# EAGLE design TINRS - PicoLooper (EAGLE 7.7.0)

## Sheet 1 of 5: MCU & Eeprom
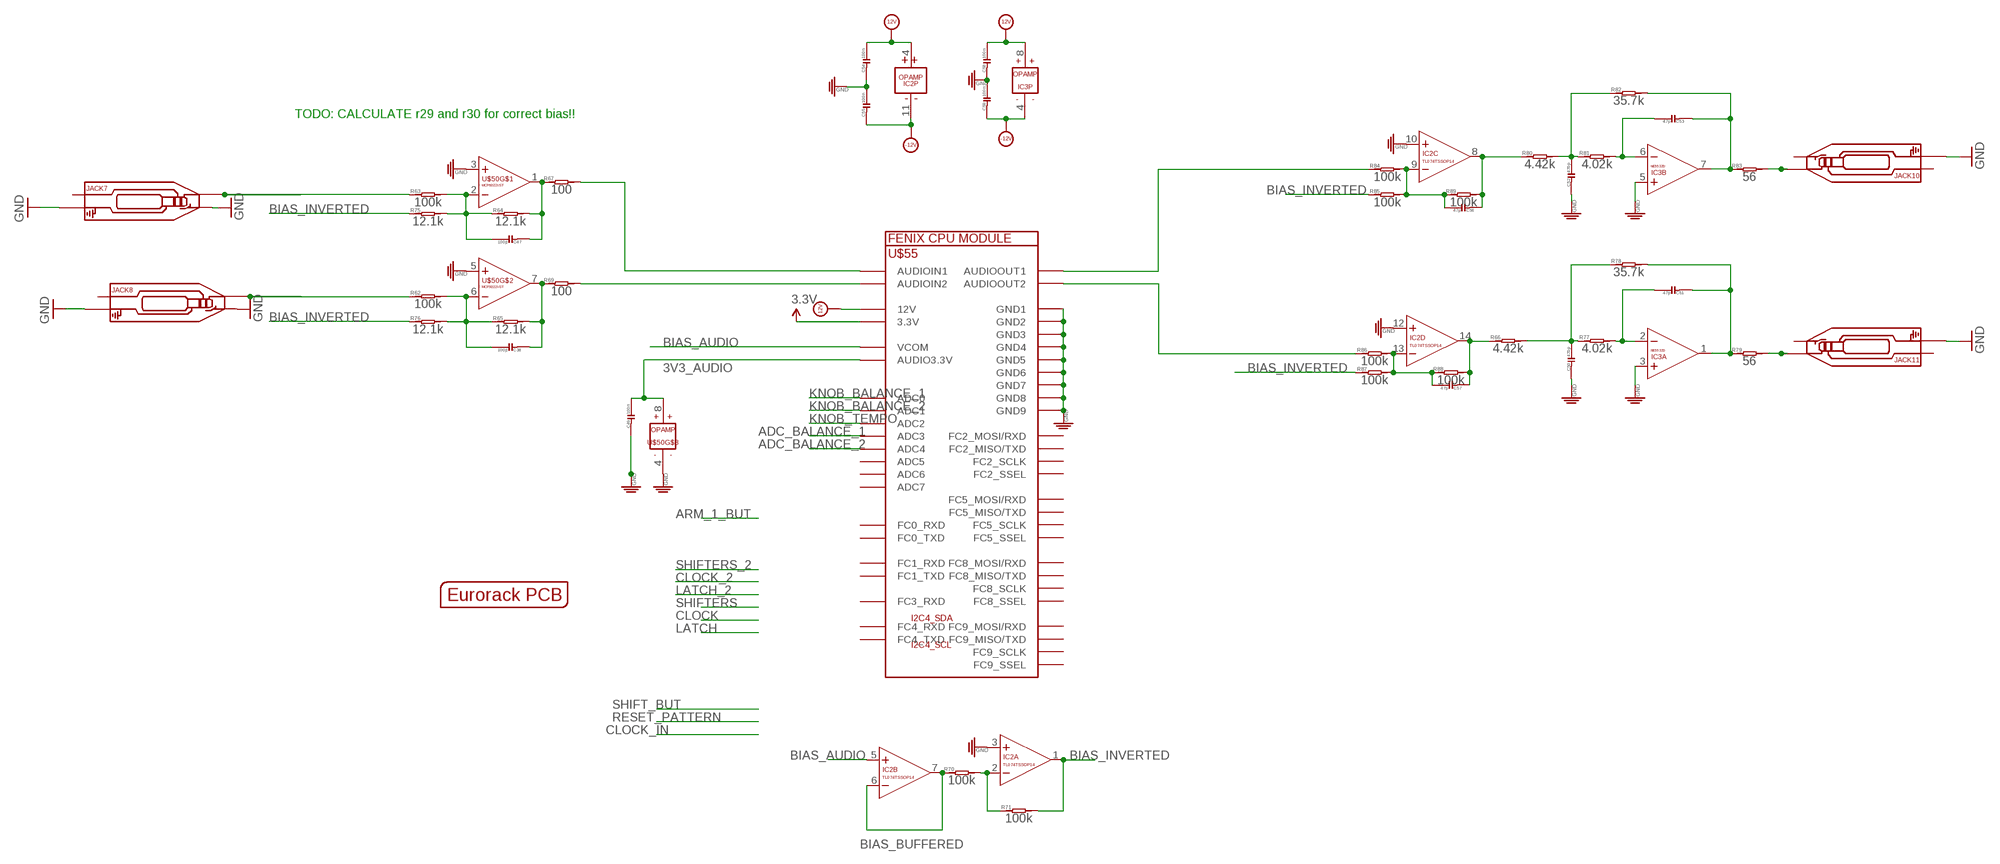
[diagram p0: schematic, sheet 1]

### Parts
C38  100p  C-0603  [C0603]
C47  100p  C-0603  [C0603]
C49  100n  C-0603  [C0603]
C50  470p  C-0603  [C0603]
C51  47p  C-0603  [C0603]
C52  470p  C-0603  [C0603]
C53  47p  C-0603  [C0603]
C54  100n  C-0603  [C0603]
C55  100n  C-0603  [C0603]
C56  47p  C-0603  [C0603]
C57  47p  C-0603  [C0603]
C58  100n  C-0603  [C0603]
C59  100n  C-0603  [C0603]
IC2  TL074TSSOP14  [TSSOP14]
IC3  NE5532D  [SO08]
JACK7  AUDIO-JACK_SMALLSYMBOL  [3.5MM-JACK-SWITCH-13MM-NOHOLES-TESTPAD]
JACK8  AUDIO-JACK_SMALLSYMBOL  [3.5MM-JACK-SWITCH-13MM-NOHOLES-TESTPAD]
JACK10  AUDIO-JACK_SMALLSYMBOL  [3.5MM-JACK-SWITCH-13MM-NOHOLES-TESTPAD]
JACK11  AUDIO-JACK_SMALLSYMBOL  [3.5MM-JACK-SWITCH-13MM-NOHOLES-TESTPAD]
OUTLINE  EURORACK_PCB12HP  [EURORACK12HPPCB]
R62  100k  R-0603  [R0603]
R63  100k  R-0603  [R0603]
R64  12.1k  R-0603  [R0603]
R65  12.1k  R-0603  [R0603]
R66  4.42k  R-0603  [R0603]
R67  100  R-0603  [R0603]
R69  100  R-0603  [R0603]
R70  100k  R-0603  [R0603]
R71  100k  R-0603  [R0603]
R75  12.1k  R-0603  [R0603]
R76  12.1k  R-0603  [R0603]
R77  4.02k  R-0603  [R0603]
R78  35.7k  R-0603  [R0603]
R79  56  R-0603  [R0603]
R80  4.42k  R-0603  [R0603]
R81  4.02k  R-0603  [R0603]
R82  35.7k  R-0603  [R0603]
R83  56  R-0603  [R0603]
R84  100k  R-0603  [R0603]
R85  100k  R-0603  [R0603]
R86  100k  R-0603  [R0603]
R87  100k  R-0603  [R0603]
R88  100k  R-0603  [R0603]
R89  100k  R-0603  [R0603]
U$50  MCP6022I/ST  [TSSOP8]
U$55  MCUPLUGIN2  [MCUPLUGIN]

### Nets
3.3V: U$55.P$7(3.3V) ; also sheet 2,4,5
3V3_AUDIO [heavypower]: C49.2 U$50.8(V+) U$55.P$48(AUDIO3.3V)
12V [heavypower]: C54.2 C58.2 IC2.4(P:V+) IC3.8(P:V+) U$55.P$45(12V) ; also sheet 2,4
-12V [heavypower]: C55.1 C59.1 IC2.11(P:V-) IC3.4(P:V-) ; also sheet 4
ADC_BALANCE_1: U$55.P$28(ADC3) ; also sheet 5
ADC_BALANCE_2: U$55.P$29(ADC4) ; also sheet 5
BIAS_AUDIO: IC2.5(B:+IN) U$55.P$47(VCOM)
BIAS_BUFFERED: IC2.6(B:-IN) IC2.7(B:OUT) R70.1
BIAS_INVERTED: IC2.1(A:OUT) R71.2 R75.1 R76.1 R85.1 R87.1
GND: C49.1 C50.1 C52.1 C54.1 C55.2 C58.1 C59.2 IC2.3(A:+IN) IC2.10(C:+IN) IC2.12(D:+IN) IC3.3(A:+IN) IC3.5(B:+IN) JACK7.RING_B@1(RING) JACK7.RING_T@3(RING) JACK7.SWITCH_B@1(SWITCH) JACK7.SWITCH_T@3(SWITCH) JACK8.RING_B@1(RING) JACK8.RING_T@3(RING) JACK8.SWITCH_B@1(SWITCH) JACK8.SWITCH_T@3(SWITCH) JACK10.RING_B@1(RING) JACK10.RING_T@3(RING) JACK11.RING_B@1(RING) JACK11.RING_T@3(RING) U$50.3(+IN) U$50.4(V-) U$50.5(+IN) U$55.P$1(GND1) U$55.P$6(GND2) U$55.P$8(GND3) U$55.P$23(GND4) U$55.P$24(GND5) U$55.P$33(GND6) U$55.P$39(GND7) U$55.P$40(GND8) U$55.P$46(GND9) ; also sheet 2,4,5
KNOB_BALANCE_1: U$55.P$25(ADC0) ; also sheet 5
KNOB_BALANCE_2: U$55.P$26(ADC1) ; also sheet 5
KNOB_TEMPO: U$55.P$27(ADC2) ; also sheet 5
N$75: C38.2 R62.2 R65.1 R76.2 U$50.6(-IN)
N$77: C47.2 R63.2 R64.1 R75.2 U$50.2(-IN)
N$78: C38.1 R65.2 R69.1 U$50.7(OUT)
N$79: C47.1 R64.2 R67.1 U$50.1(OUT)
N$83: IC2.2(A:-IN) R70.2 R71.1
N$84: C51.2 IC3.2(A:-IN) R77.2
N$85: C50.2 R66.2 R77.1 R78.1
N$88: C51.1 IC3.1(A:OUT) R78.2 R79.1
N$89: JACK11.TIP_B@1(TIP) JACK11.TIP_T@3(TIP) R79.2
N$90: C53.2 IC3.6(B:-IN) R81.2
N$91: C52.2 R80.2 R81.1 R82.1
N$92: C53.1 IC3.7(B:OUT) R82.2 R83.1
N$94: JACK10.TIP_B@1(TIP) JACK10.TIP_T@3(TIP) R83.2
N$101: C56.2 IC2.9(C:-IN) R84.2 R85.2 R89.1
N$102: C57.2 IC2.13(D:-IN) R86.2 R87.2 R88.1
N$103: C56.1 IC2.8(C:OUT) R80.1 R89.2
N$104: R86.1 U$55.P$44(AUDIOOUT2)
N$105: R84.1 U$55.P$42(AUDIOOUT1)
N$106: C57.1 IC2.14(D:OUT) R66.1 R88.2
N$107: JACK7.TIP_B@1(TIP) JACK7.TIP_T@3(TIP) R63.1
N$108: JACK8.TIP_B@1(TIP) JACK8.TIP_T@3(TIP) R62.1
TO_AUDIOIN_1: R67.2 U$55.P$41(AUDIOIN1)
TO_AUDIOIN_2: R69.2 U$55.P$43(AUDIOIN2)
Unconnected: JACK7.SECOND_B@1(SECOND) JACK7.SECOND_T@3(SECOND) JACK8.SECOND_B@1(SECOND) JACK8.SECOND_T@3(SECOND) JACK10.SECOND_B@1(SECOND) JACK10.SECOND_T@3(SECOND) JACK10.SWITCH_B@1(SWITCH) JACK10.SWITCH_T@3(SWITCH) JACK11.SECOND_B@1(SECOND) JACK11.SECOND_T@3(SECOND) JACK11.SWITCH_B@1(SWITCH) JACK11.SWITCH_T@3(SWITCH) U$55.P$2(FC9_MOSI/RXD) U$55.P$3(FC9_MISO/TXD) U$55.P$4(FC9_SCLK) U$55.P$5(FC9_SSEL) U$55.P$9(FC2_MOSI/RXD) U$55.P$10(FC2_MISO/TXD) U$55.P$11(FC2_SCLK) U$55.P$12(FC2_SSEL) U$55.P$13(FC8_MISO/TXD) U$55.P$14(FC8_MOSI/RXD) U$55.P$15(FC8_SCLK) U$55.P$16(FC8_SSEL) U$55.P$17(FC4_TXD) U$55.P$18(FC4_RXD) U$55.P$19(FC5_SSEL) U$55.P$20(FC5_SCLK) U$55.P$21(FC5_MISO/TXD) U$55.P$22(FC5_MOSI/RXD) U$55.P$30(ADC5) U$55.P$31(ADC6) U$55.P$32(ADC7) U$55.P$34(FC3_RXD) U$55.P$35(FC0_TXD) U$55.P$36(FC0_RXD) U$55.P$37(FC1_TXD) U$55.P$38(FC1_RXD)

### Notes on the sheet
- TODO: CALCULATE r29 and r30 for correct bias!!

## Sheet 2 of 5: LEDs & button
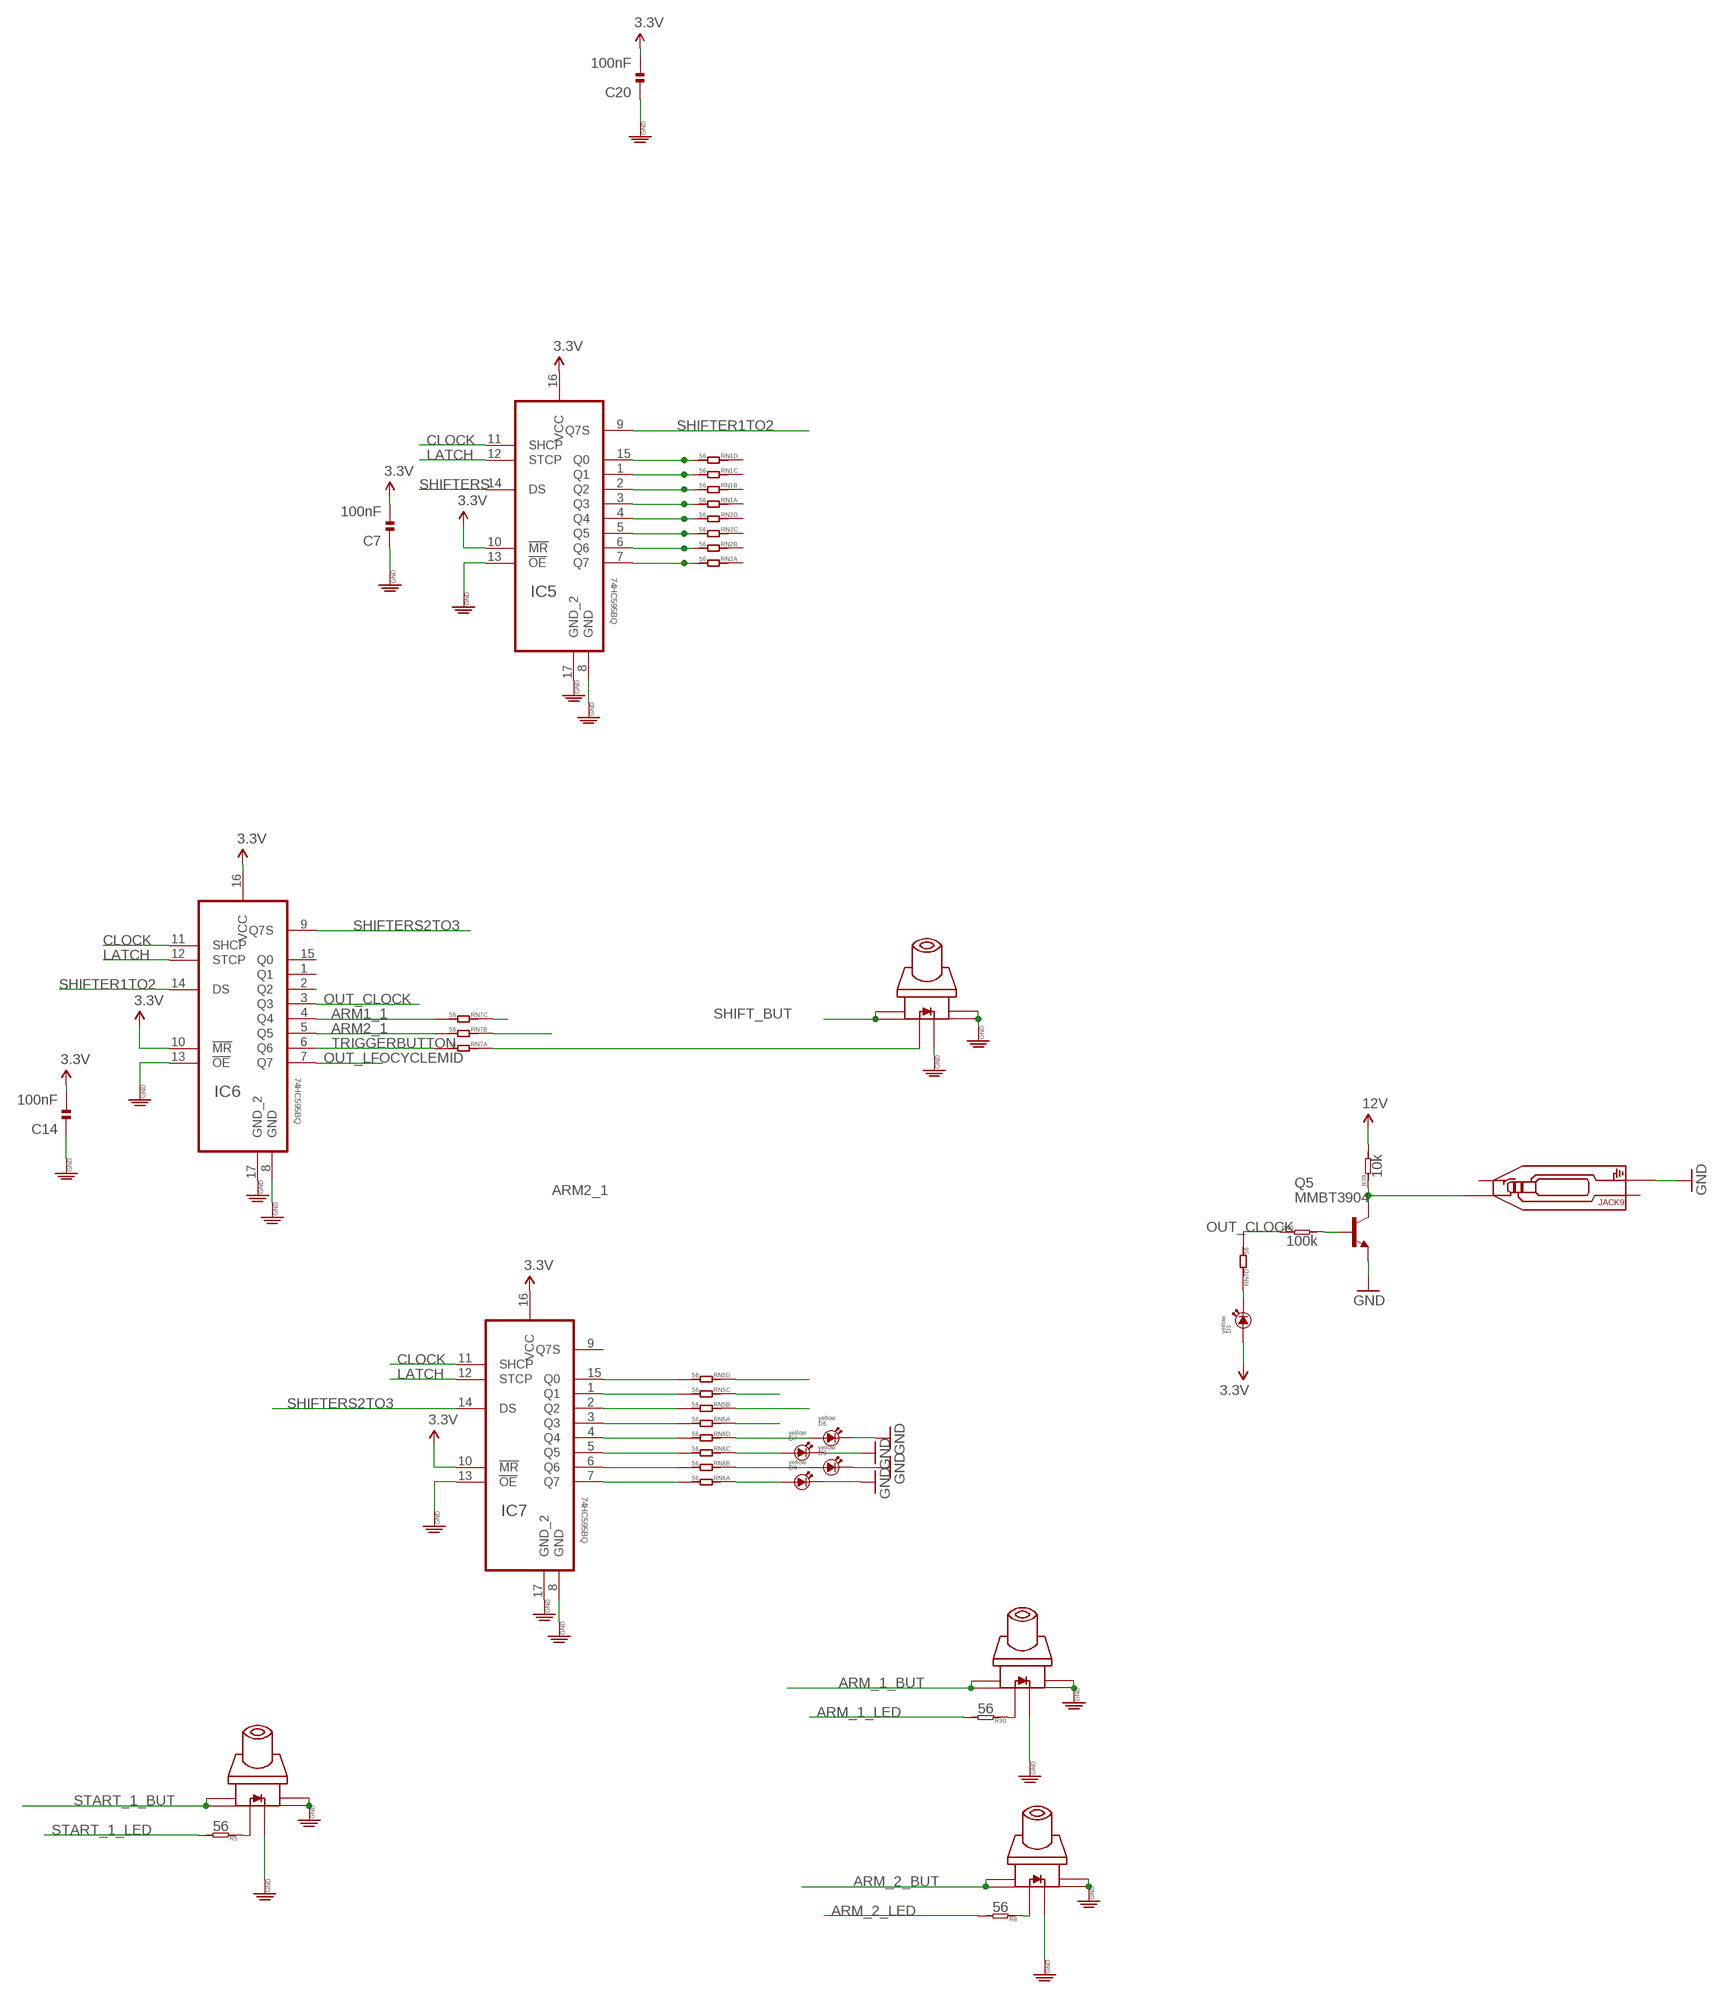
[diagram p1: schematic, sheet 2, part 1 of 3]
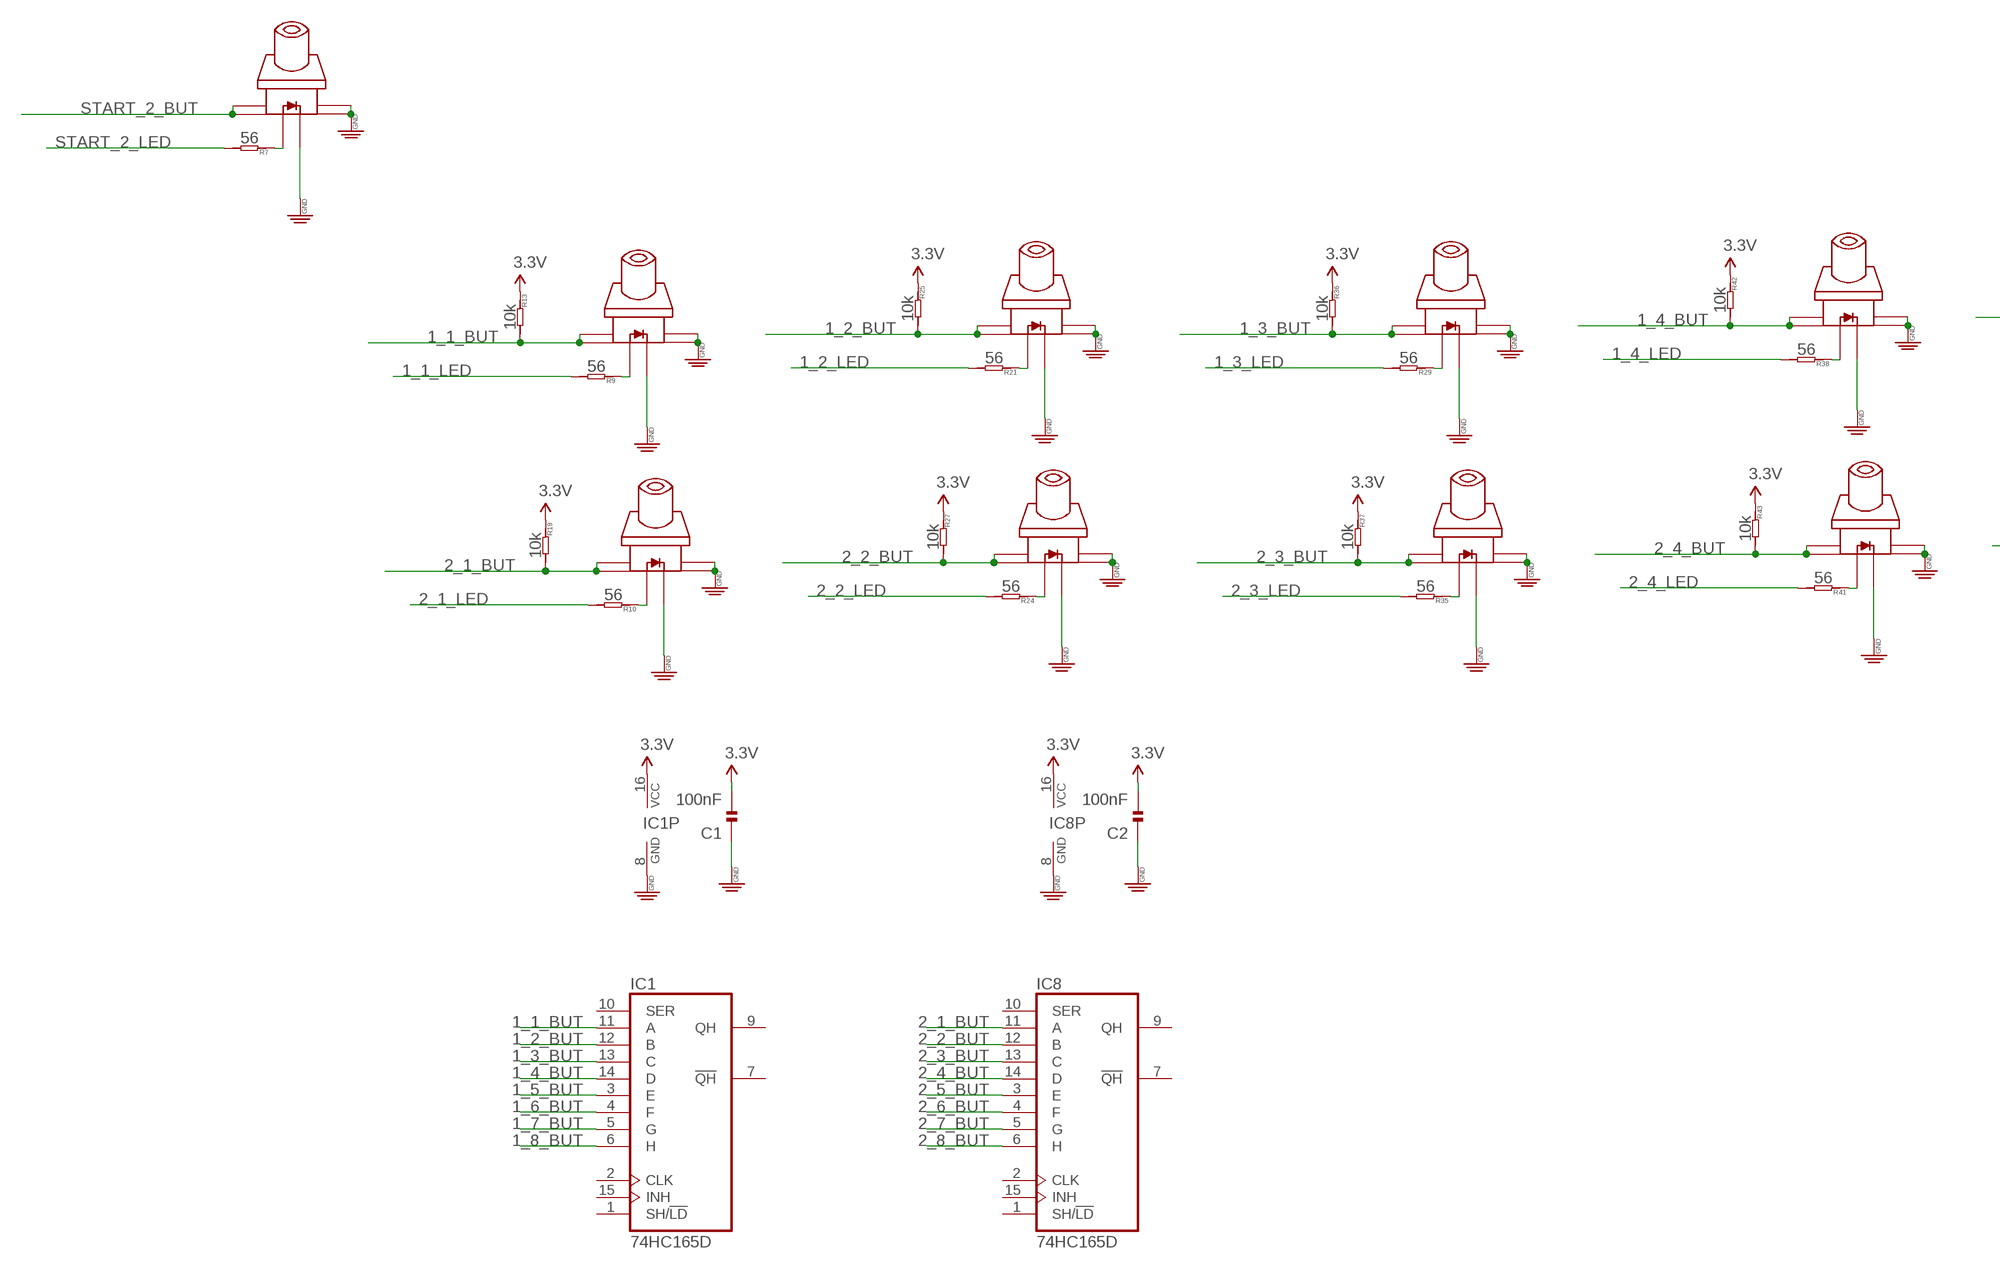
[diagram p2: schematic, sheet 2, part 2 of 3]
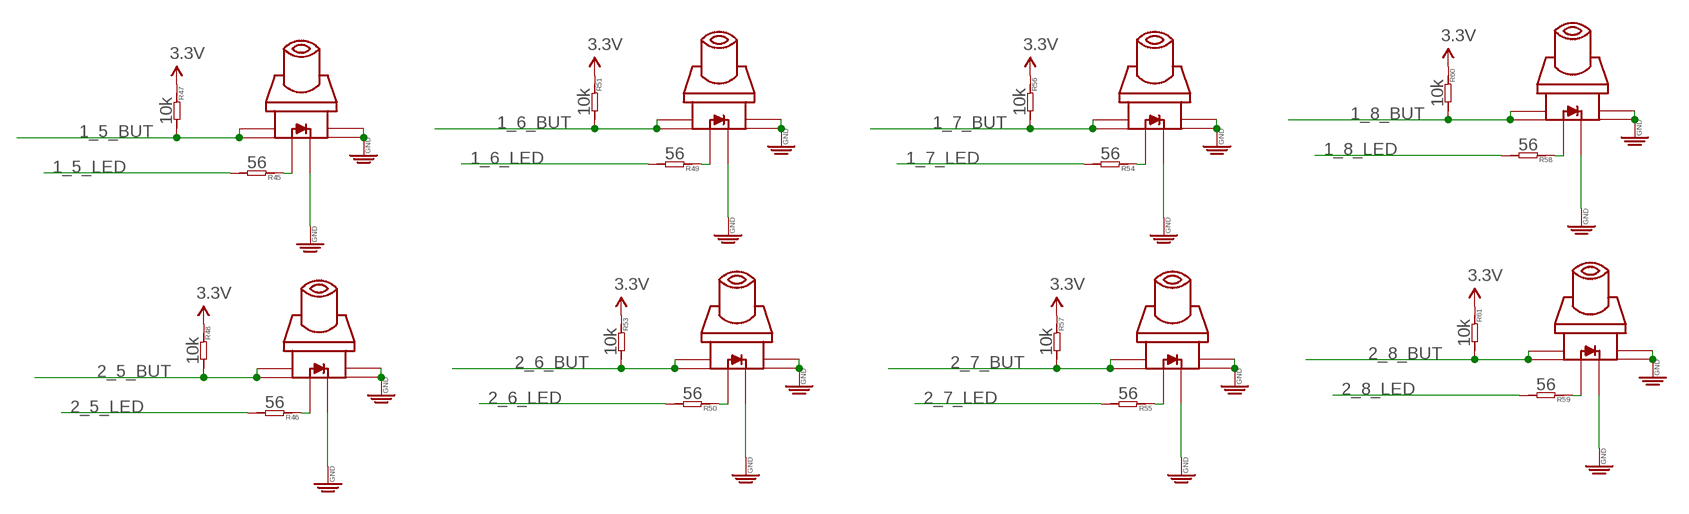
[diagram p3: schematic, sheet 2, part 3 of 3]

### Parts
C1  100nF  C-EUC0402  [C0402]
C2  100nF  C-EUC0402  [C0402]
C7  100nF  C-EUC0402  [C0402]
C14  100nF  C-EUC0402  [C0402]
C20  100nF  C-EUC0402  [C0402]
D3  yellow  LED3MM  [3MMLED]
D6  yellow  LED3MM  [3MMLED]
D7  yellow  LED3MM  [3MMLED]
D8  yellow  LED3MM  [3MMLED]
D9  yellow  LED3MM  [3MMLED]
IC1  74HC165D  [SO16]
IC5  74HC595BQ  [QFN50P250X350X100-17N]
IC6  74HC595BQ  [QFN50P250X350X100-17N]
IC7  74HC595BQ  [QFN50P250X350X100-17N]
IC8  74HC165D  [SO16]
JACK9  AUDIO-JACK_SMALLSYMBOL  [3.5MM-JACK-SWITCH-13MM-NOHOLES-TESTPAD]
Q5  MMBT3904  MMBT3904LT1-NPN-SOT23-BEC  [SOT23-BEC]
R5  56  R-0603  [R0603]
R7  56  R-0603  [R0603]
R8  56  R-0603  [R0603]
R9  56  R-0603  [R0603]
R10  56  R-0603  [R0603]
R13  10k  R-0603  [R0603]
R19  10k  R-0603  [R0603]
R21  56  R-0603  [R0603]
R24  56  R-0603  [R0603]
R25  10k  R-0603  [R0603]
R27  10k  R-0603  [R0603]
R29  56  R-0603  [R0603]
R30  56  R-0603  [R0603]
R35  56  R-0603  [R0603]
R36  10k  R-0603  [R0603]
R37  10k  R-0603  [R0603]
R38  56  R-0603  [R0603]
R39  10k  R-0603  [R0603]
R40  100k  R-0603  [R0603]
R41  56  R-0603  [R0603]
R42  10k  R-0603  [R0603]
R43  10k  R-0603  [R0603]
R45  56  R-0603  [R0603]
R46  56  R-0603  [R0603]
R47  10k  R-0603  [R0603]
R48  10k  R-0603  [R0603]
R49  56  R-0603  [R0603]
R50  56  R-0603  [R0603]
R51  10k  R-0603  [R0603]
R53  10k  R-0603  [R0603]
R54  56  R-0603  [R0603]
R55  56  R-0603  [R0603]
R56  10k  R-0603  [R0603]
R57  10k  R-0603  [R0603]
R58  56  R-0603  [R0603]
R59  56  R-0603  [R0603]
R60  10k  R-0603  [R0603]
R61  10k  R-0603  [R0603]
RN1  56  4R-N0402ARV341  [4X0402ARV341]
RN2  56  4R-N0402ARV341  [4X0402ARV341]
RN5  56  4R-N0402ARV341  [4X0402ARV341]
RN6  56  4R-N0402ARV341  [4X0402ARV341]
RN7  56  4R-N0402ARV341  [4X0402ARV341]
U$1  SWITCH_W_LED_PB6149L-X-102YELLOW  [PB6149L]
U$11  SWITCH_W_LED_PB6149L-X-102YELLOW  [PB6149L]
U$12  SWITCH_W_LED_PB6149L-X-102YELLOW  [PB6149L]
U$13  SWITCH_W_LED_PB6149L-X-102YELLOW  [PB6149L]
U$23  SWITCH_W_LED_PB6149L-X-102YELLOW  [PB6149L]
U$24  SWITCH_W_LED_PB6149L-X-102YELLOW  [PB6149L]
U$28  SWITCH_W_LED_PB6149L-X-102YELLOW  [PB6149L]
U$31  SWITCH_W_LED_PB6149L-X-102YELLOW  [PB6149L]
U$32  SWITCH_W_LED_PB6149L-X-102YELLOW  [PB6149L]
U$33  SWITCH_W_LED_PB6149L-X-102YELLOW  [PB6149L]
U$34  SWITCH_W_LED_PB6149L-X-102YELLOW  [PB6149L]
U$35  SWITCH_W_LED_PB6149L-X-102YELLOW  [PB6149L]
U$36  SWITCH_W_LED_PB6149L-X-102YELLOW  [PB6149L]
U$37  SWITCH_W_LED_PB6149L-X-102YELLOW  [PB6149L]
U$38  SWITCH_W_LED_PB6149L-X-102YELLOW  [PB6149L]
U$39  SWITCH_W_LED_PB6149L-X-102YELLOW  [PB6149L]
U$40  SWITCH_W_LED_PB6149L-X-102YELLOW  [PB6149L]
U$41  SWITCH_W_LED_PB6149L-X-102YELLOW  [PB6149L]
U$42  SWITCH_W_LED_PB6149L-X-102YELLOW  [PB6149L]
U$43  SWITCH_W_LED_PB6149L-X-102YELLOW  [PB6149L]
U$44  SWITCH_W_LED_PB6149L-X-102YELLOW  [PB6149L]

### Nets
1_1_BUT: IC1.11(A) R13.2 U$23.1 U$23.2
1_1_LED: R9.2
1_2_BUT: IC1.12(B) R25.2 U$31.1 U$31.2
1_2_LED: R21.2
1_3_BUT: IC1.13(C) R36.2 U$33.1 U$33.2
1_3_LED: R29.2
1_4_BUT: IC1.14(D) R42.2 U$35.1 U$35.2
1_4_LED: R38.2
1_5_BUT: IC1.3(E) R47.2 U$37.1 U$37.2
1_5_LED: R45.2
1_6_BUT: IC1.4(F) R51.2 U$39.1 U$39.2
1_6_LED: R49.2
1_7_BUT: IC1.5(G) R56.2 U$41.1 U$41.2
1_7_LED: R54.2
1_8_BUT: IC1.6(H) R60.2 U$43.1 U$43.2
1_8_LED: R58.2
2_1_BUT: IC8.11(A) R19.2 U$24.1 U$24.2
2_1_LED: R10.2
2_2_BUT: IC8.12(B) R27.2 U$32.1 U$32.2
2_2_LED: R24.2
2_3_BUT: IC8.13(C) R37.2 U$34.1 U$34.2
2_3_LED: R35.2
2_4_BUT: IC8.14(D) R43.2 U$36.1 U$36.2
2_4_LED: R41.2
2_5_BUT: IC8.3(E) R48.2 U$38.1 U$38.2
2_5_LED: R46.2
2_6_BUT: IC8.4(F) R53.2 U$40.1 U$40.2
2_6_LED: R50.2
2_7_BUT: IC8.5(G) R57.2 U$42.1 U$42.2
2_7_LED: R55.2
2_8_BUT: IC8.6(H) R61.2 U$44.1 U$44.2
2_8_LED: R59.2
3.3V: C1.2 C2.2 C7.2 C14.2 C20.2 D3.+ IC1.16(VCC) IC5.10(!MR) IC5.16(VCC) IC6.10(!MR) IC6.16(VCC) IC7.10(!MR) IC7.16(VCC) IC8.16(VCC) R13.1 R19.1 R25.1 R27.1 R36.1 R37.1 R42.1 R43.1 R47.1 R48.1 R51.1 R53.1 R56.1 R57.1 R60.1 R61.1 ; also sheet 1,4,5
12V [heavypower]: R39.2 ; also sheet 1,4
ARM1_1: IC6.4(Q4) RN7.3
ARM2_1: IC6.5(Q5) RN7.2
ARM_1_BUT: U$28.1 U$28.2 ; also sheet 1
ARM_1_LED: R30.2
ARM_2_BUT: U$13.1 U$13.2
ARM_2_LED: R8.2
CLOCK: IC5.11(SHCP) IC6.11(SHCP) IC7.11(SHCP) ; also sheet 1
GND: C1.1 C2.1 C7.1 C14.1 C20.1 D6.- D7.- D8.- D9.- IC1.8(GND) IC5.8(GND) IC5.13(!OE) IC5.17(GND_2) IC6.8(GND) IC6.13(!OE) IC6.17(GND_2) IC7.8(GND) IC7.13(!OE) IC7.17(GND_2) IC8.8(GND) JACK9.RING_B@1(RING) JACK9.RING_T@3(RING) Q5.E U$1.3 U$1.4 U$1.LEDNEG(NEG) U$11.3 U$11.4 U$11.LEDNEG(NEG) U$12.3 U$12.4 U$12.LEDNEG(NEG) U$13.3 U$13.4 U$13.LEDNEG(NEG) U$23.3 U$23.4 U$23.LEDNEG(NEG) U$24.3 U$24.4 U$24.LEDNEG(NEG) U$28.3 U$28.4 U$28.LEDNEG(NEG) U$31.3 U$31.4 U$31.LEDNEG(NEG) U$32.3 U$32.4 U$32.LEDNEG(NEG) U$33.3 U$33.4 U$33.LEDNEG(NEG) U$34.3 U$34.4 U$34.LEDNEG(NEG) U$35.3 U$35.4 U$35.LEDNEG(NEG) U$36.3 U$36.4 U$36.LEDNEG(NEG) U$37.3 U$37.4 U$37.LEDNEG(NEG) U$38.3 U$38.4 U$38.LEDNEG(NEG) U$39.3 U$39.4 U$39.LEDNEG(NEG) U$40.3 U$40.4 U$40.LEDNEG(NEG) U$41.3 U$41.4 U$41.LEDNEG(NEG) U$42.3 U$42.4 U$42.LEDNEG(NEG) U$43.3 U$43.4 U$43.LEDNEG(NEG) U$44.3 U$44.4 U$44.LEDNEG(NEG) ; also sheet 1,4,5
LATCH: IC5.12(STCP) IC6.12(STCP) IC7.12(STCP) ; also sheet 1
N$1: IC5.15(Q0) RN1.4
N$5: R5.1 U$11.LEDPOS(POS)
N$7: R7.1 U$12.LEDPOS(POS)
N$9: R8.1 U$13.LEDPOS(POS)
N$10: R9.1 U$23.LEDPOS(POS)
N$14: D7.+ RN6.6
N$19: IC5.1(Q1) RN1.3
N$20: R10.1 U$24.LEDPOS(POS)
N$21: R21.1 U$31.LEDPOS(POS)
N$22: IC5.2(Q2) RN1.2
N$23: R24.1 U$32.LEDPOS(POS)
N$25: R29.1 U$33.LEDPOS(POS)
N$26: IC5.3(Q3) RN1.1
N$27: D3.- RN7.5
N$28: R35.1 U$34.LEDPOS(POS)
N$29: R38.1 U$35.LEDPOS(POS)
N$30: IC5.4(Q4) RN2.4
N$31: IC5.5(Q5) RN2.3
N$32: R41.1 U$36.LEDPOS(POS)
N$35: IC5.6(Q6) RN2.2
N$36: IC5.7(Q7) RN2.1
N$37: R45.1 U$37.LEDPOS(POS)
N$38: IC7.7(Q7) RN6.1
N$39: IC7.6(Q6) RN6.2
N$40: IC7.5(Q5) RN6.3
N$41: RN7.7
N$42: R46.1 U$38.LEDPOS(POS)
N$43: IC7.4(Q4) RN6.4
N$46: D6.+ RN6.5
N$47: RN5.8
N$48: RN5.7
N$49: D8.+ RN6.7
N$50: D9.+ RN6.8
N$51: R49.1 U$39.LEDPOS(POS)
N$52: RN5.5
N$53: IC7.3(Q3) RN5.1
N$54: IC7.2(Q2) RN5.2
N$55: IC7.1(Q1) RN5.3
N$56: IC7.15(Q0) RN5.4
N$57: R50.1 U$40.LEDPOS(POS)
N$58: R54.1 U$41.LEDPOS(POS)
N$59: R55.1 U$42.LEDPOS(POS)
N$60: Q5.B R40.2
N$61: JACK9.TIP_B@1(TIP) JACK9.TIP_T@3(TIP) Q5.C R39.1
N$62: R58.1 U$43.LEDPOS(POS)
N$63: R59.1 U$44.LEDPOS(POS)
N$71: R30.1 U$28.LEDPOS(POS)
N$76: RN7.6
N$80: RN5.6
OUT_CLOCK: IC6.3(Q3) R40.1 RN7.4
OUT_LFOCYCLEMID: IC6.7(Q7)
SHIFT_BUT: U$1.1 U$1.2 ; also sheet 1
SHIFT_LED: RN7.8 U$1.LEDPOS(POS)
SHIFTER1TO2: IC5.9(Q7S) IC6.14(DS)
SHIFTERS: IC5.14(DS) ; also sheet 1
SHIFTERS2TO3: IC6.9(Q7S) IC7.14(DS)
START_1_BUT: U$11.1 U$11.2
START_1_LED: R5.2
START_2_BUT: U$12.1 U$12.2
START_2_LED: R7.2
TRIGGERBUTTON: IC6.6(Q6) RN7.1
Unconnected: IC1.1(SH/!LD) IC1.2(CLK) IC1.7(!QH) IC1.9(QH) IC1.10(SER) IC1.15(INH) IC6.1(Q1) IC6.2(Q2) IC6.15(Q0) IC7.9(Q7S) IC8.1(SH/!LD) IC8.2(CLK) IC8.7(!QH) IC8.9(QH) IC8.10(SER) IC8.15(INH) JACK9.SECOND_B@1(SECOND) JACK9.SECOND_T@3(SECOND) JACK9.SWITCH_B@1(SWITCH) JACK9.SWITCH_T@3(SWITCH) RN1.5 RN1.6 RN1.7 RN1.8 RN2.5 RN2.6 RN2.7 RN2.8

## Sheet 3 of 5: DAC & Trigger outs

## Sheet 4 of 5: Power
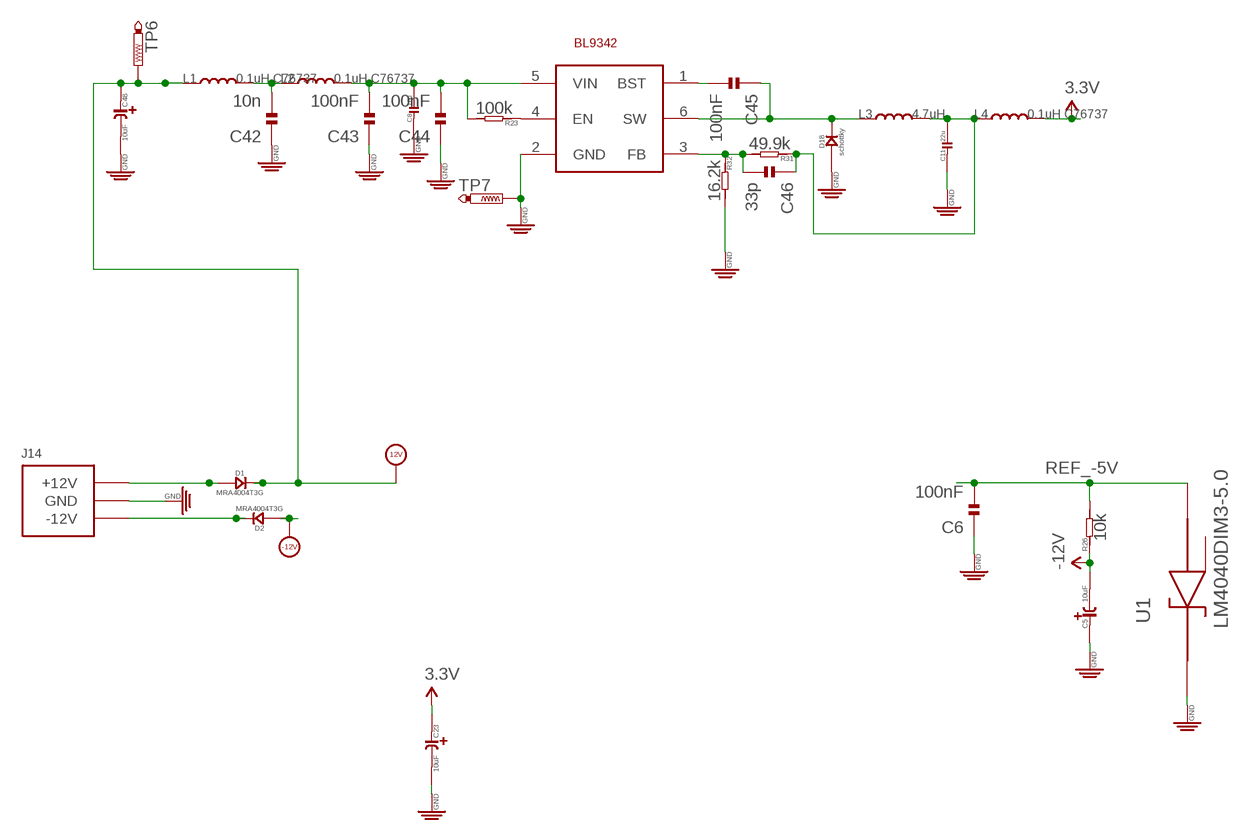
[diagram p4: schematic, sheet 4]

### Parts
C5  10uF  C-POLAR-A  [CASE-A_3216]
C6  100nF  C-EUC0402  [C0402]
C8  10u  C-0805  [C0805]
C11  22u  C-0805  [C0805]
C23  10uF  C-POLAR-A  [CASE-A_3216]
C42  10n  C-EUC0402  [C0402]
C43  100nF  C-EUC0402  [C0402]
C44  100nF  C-EUC0402  [C0402]
C45  100nF  C-EUC0402  [C0402]
C46  33p  C-EUC0402  [C0402]
C48  10uF  C-POLAR-A  [CASE-A_3216]
D1  MRA4004T3G  D-SMA  [DO-214AC]
D2  MRA4004T3G  D-SMA  [DO-214AC]
D18  schottky  D-SOD-123  [SOD123]
J14  POWER_SIMPLE10  [POWER_10]
L1  0.1uH C76737  L-0805  [L0805]
L2  0.1uH C76737  L-0805  [L0805]
L3  4.7uH  L-SPD3D16-4R7M  [L0420]
L4  0.1uH C76737  L-0805  [L0805]
R23  100k  R-0603  [R0603]
R26  10k  R-0603  [R0603]
R31  49.9k  R-0603  [R0603]
R32  16.2k  R-0603  [R0603]
TP6  PTR1B1,27  [B1,27]
TP7  PTR1B1,27  [B1,27]
U1  LM4040DIM3-5.0  [SOT95P237X112-3N]
U$5  BL9342  [SOT23-6]

### Nets
3.3V: C23.+ L4.2 ; also sheet 1,2,5
12V [heavypower]: C48.+ D1.2(-) L1.1 TP6.TP ; also sheet 1,2
-12V [heavypower]: C5.- D2.1(+) R26.1 ; also sheet 1
GND: C5.+ C6.1 C8.1 C11.1 C23.- C42.1 C43.1 C44.1 C48.- D18.+ J14.3(GND) J14.4(GND) J14.5(GND) J14.6(GND) J14.7(GND) J14.8(GND) R32.2 TP7.TP U1.1(CATHODE) U$5.2(GND) ; also sheet 1,2,5
N$13 [reallyheav]: D1.1(+) J14.9(+12V) J14.10(+12V)
N$64 [reallyheav]: D2.2(-) J14.1(-12V) J14.2(-12V)
N$70 [heavypower]: C42.2 L1.2 L2.1
N$93 [heavypower]: C8.2 C43.2 C44.2 L2.2 R23.2 U$5.5(VIN)
N$95: C45.2 U$5.1(BST)
N$96 [heavypower]: C45.1 D18.- L3.1 U$5.6(SW)
N$97: C46.2 R31.2 R32.1 U$5.3(FB)
N$98: C11.2 C46.1 L3.2 L4.1 R31.1
N$99 [heavypower]: R23.1 U$5.4(EN)
REF_-5V [heavypower]: C6.2 R26.2 U1.2(ANODE) ; also sheet 5
Unconnected: U1.3(NC)

## Sheet 5 of 5: Inputs & Knobs
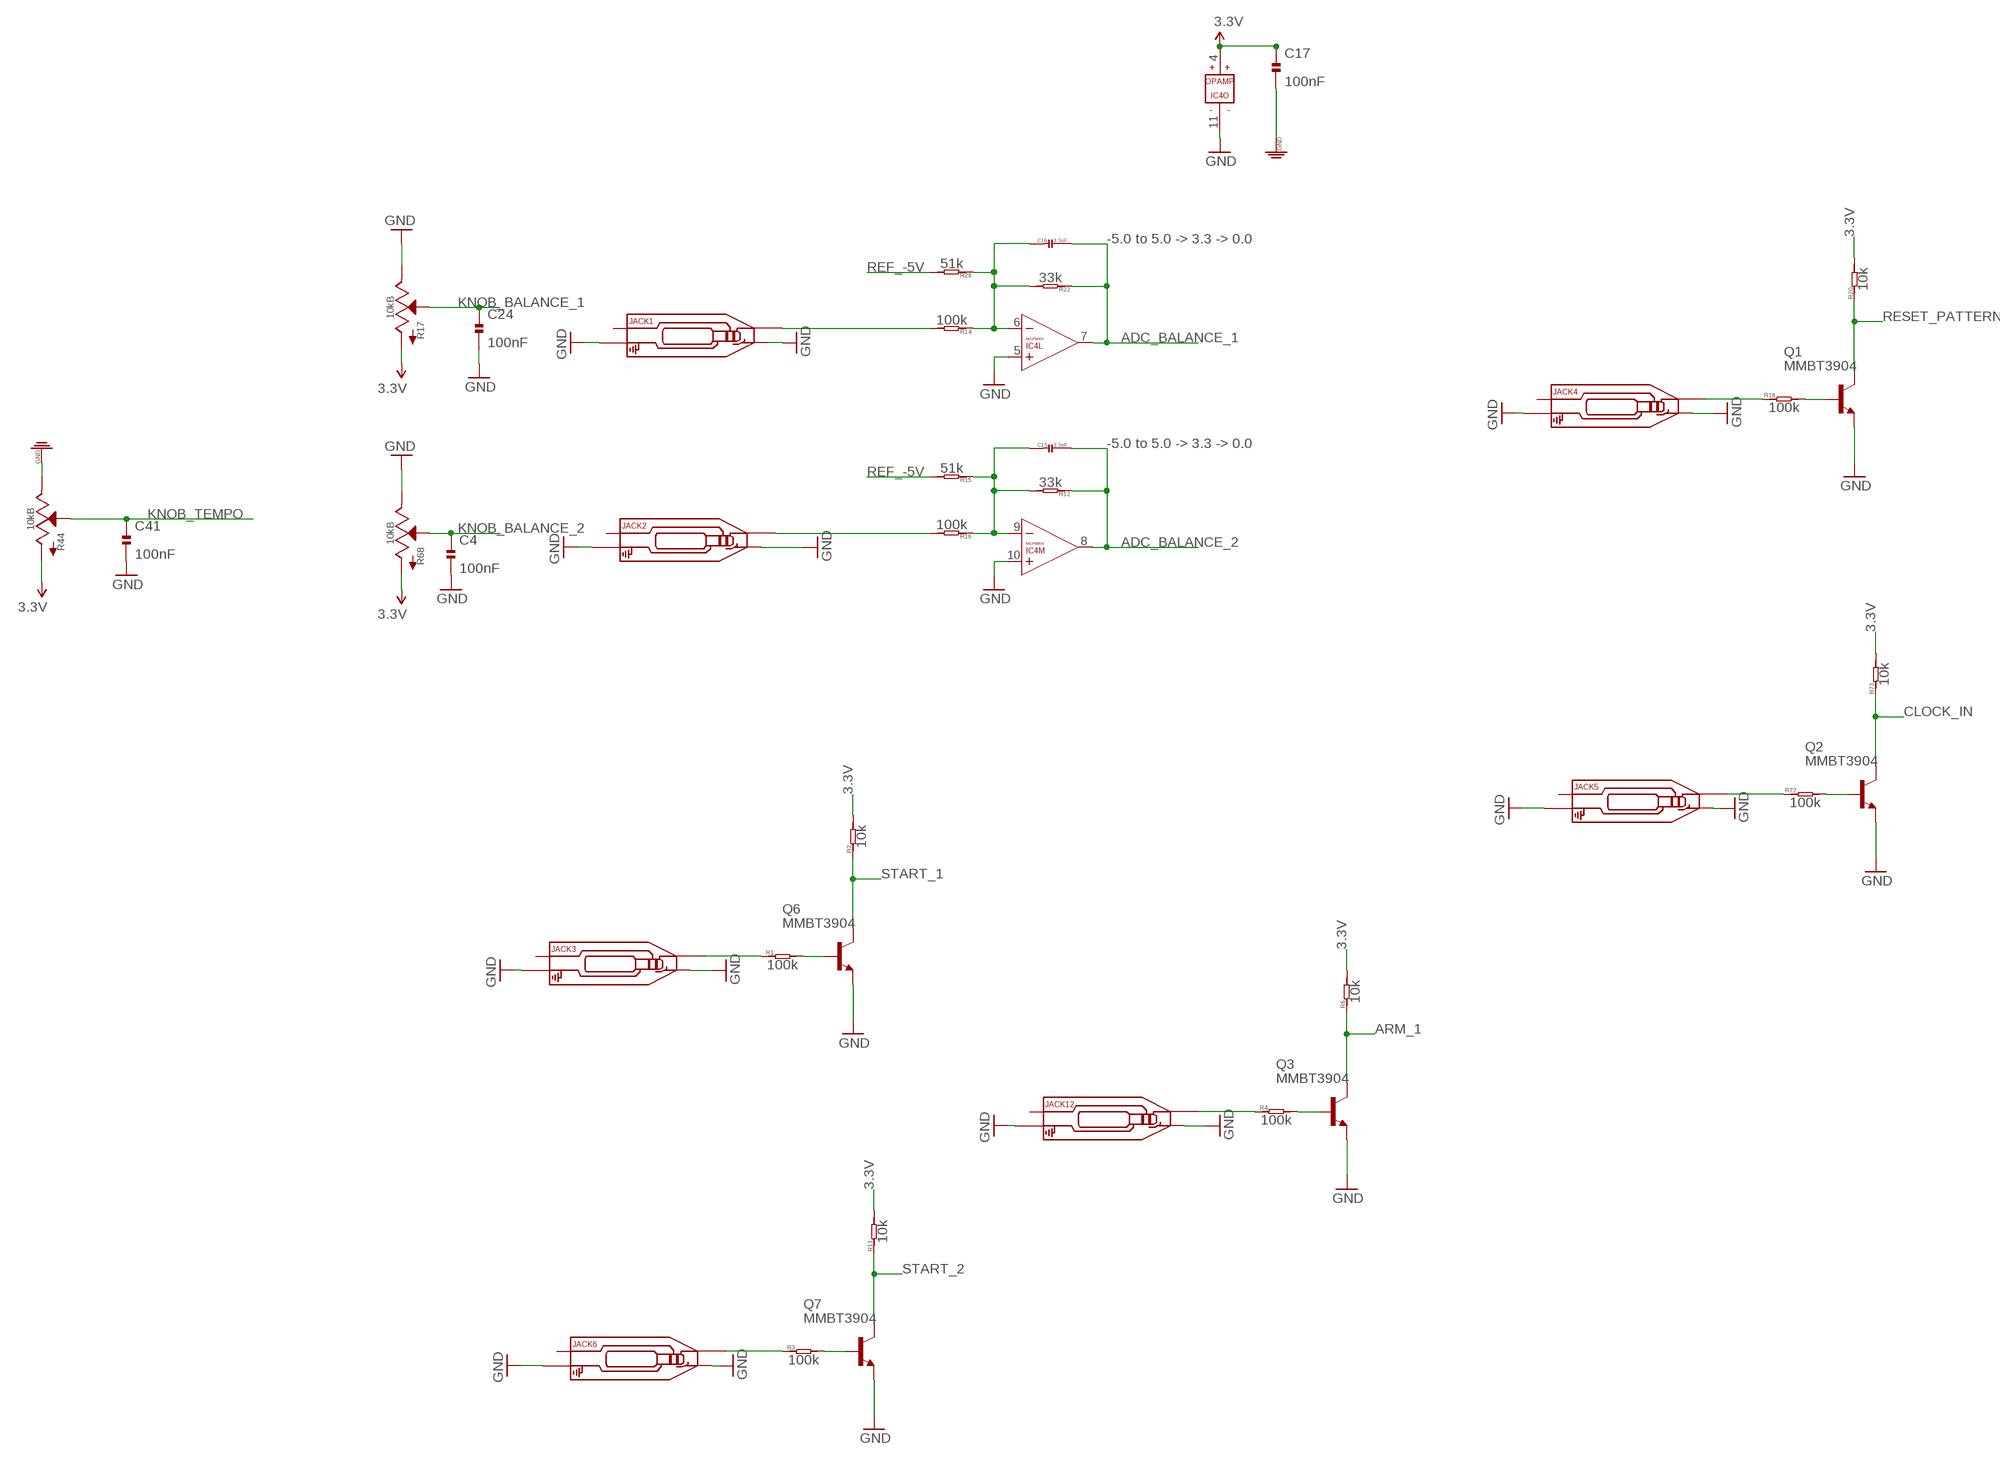
[diagram p5: schematic, sheet 5]

### Parts
C4  100nF  C-EUC0402  [C0402]
C15  3.3nF  C-0603  [C0603]
C16  3.3nF  C-0603  [C0603]
C17  100nF  C-EUC0402  [C0402]
C24  100nF  C-EUC0402  [C0402]
C41  100nF  C-EUC0402  [C0402]
IC4  MCP6004  [SO14]
JACK1  AUDIO-JACK_SMALLSYMBOL  [3.5MM-JACK-SWITCH-13MM-NOHOLES-TESTPAD]
JACK2  AUDIO-JACK_SMALLSYMBOL  [3.5MM-JACK-SWITCH-13MM-NOHOLES-TESTPAD]
JACK3  AUDIO-JACK_SMALLSYMBOL  [3.5MM-JACK-SWITCH-13MM-NOHOLES-TESTPAD]
JACK4  AUDIO-JACK_SMALLSYMBOL  [3.5MM-JACK-SWITCH-13MM-NOHOLES-TESTPAD]
JACK5  AUDIO-JACK_SMALLSYMBOL  [3.5MM-JACK-SWITCH-13MM-NOHOLES-TESTPAD]
JACK6  AUDIO-JACK_SMALLSYMBOL  [3.5MM-JACK-SWITCH-13MM-NOHOLES-TESTPAD]
JACK12  AUDIO-JACK_SMALLSYMBOL  [3.5MM-JACK-SWITCH-13MM-NOHOLES-TESTPAD]
Q1  MMBT3904  MMBT3904LT1-NPN-SOT23-BEC  [SOT23-BEC]
Q2  MMBT3904  MMBT3904LT1-NPN-SOT23-BEC  [SOT23-BEC]
Q3  MMBT3904  MMBT3904LT1-NPN-SOT23-BEC  [SOT23-BEC]
Q6  MMBT3904  MMBT3904LT1-NPN-SOT23-BEC  [SOT23-BEC]
Q7  MMBT3904  MMBT3904LT1-NPN-SOT23-BEC  [SOT23-BEC]
R1  100k  R-0603  [R0603]
R2  10k  R-0603  [R0603]
R3  100k  R-0603  [R0603]
R4  100k  R-0603  [R0603]
R6  10k  R-0603  [R0603]
R11  10k  R-0603  [R0603]
R12  33k  R-0603  [R0603]
R14  100k  R-0603  [R0603]
R15  51k  R-0603  [R0603]
R16  100k  R-0603  [R0603]
R17  10kB  POTSQUAREHOLE_SMALLKNOB  [ALPS_POT_SQUAREHOLES]
R18  100k  R-0603  [R0603]
R20  10k  R-0603  [R0603]
R22  33k  R-0603  [R0603]
R28  51k  R-0603  [R0603]
R44  10kB  POTSQUAREHOLE_SMALLKNOB  [ALPS_POT_SQUAREHOLES]
R68  10kB  POTSQUAREHOLE_SMALLKNOB  [ALPS_POT_SQUAREHOLES]
R72  100k  R-0603  [R0603]
R73  10k  R-0603  [R0603]

### Nets
3.3V: C17.1 IC4.4(O:V+) R2.2 R6.2 R11.2 R17.P$3(A) R20.2 R44.P$3(A) R68.P$3(A) R73.2 ; also sheet 1,2,4
ADC_BALANCE_1: C16.2 IC4.7(L:OUT) R22.1 ; also sheet 1
ADC_BALANCE_2: C15.2 IC4.8(M:OUT) R12.1 ; also sheet 1
ARM_1: Q3.C R6.1
CLOCK_IN: Q2.C R73.1 ; also sheet 1
GND: C4.2 C17.2 C24.2 C41.2 IC4.5(L:+IN) IC4.10(M:+IN) IC4.11(O:V-) JACK1.RING_B@1(RING) JACK1.RING_T@3(RING) JACK1.SWITCH_B@1(SWITCH) JACK1.SWITCH_T@3(SWITCH) JACK2.RING_B@1(RING) JACK2.RING_T@3(RING) JACK2.SWITCH_B@1(SWITCH) JACK2.SWITCH_T@3(SWITCH) JACK3.RING_B@1(RING) JACK3.RING_T@3(RING) JACK3.SWITCH_B@1(SWITCH) JACK3.SWITCH_T@3(SWITCH) JACK4.RING_B@1(RING) JACK4.RING_T@3(RING) JACK4.SWITCH_B@1(SWITCH) JACK4.SWITCH_T@3(SWITCH) JACK5.RING_B@1(RING) JACK5.RING_T@3(RING) JACK5.SWITCH_B@1(SWITCH) JACK5.SWITCH_T@3(SWITCH) JACK6.RING_B@1(RING) JACK6.RING_T@3(RING) JACK6.SWITCH_B@1(SWITCH) JACK6.SWITCH_T@3(SWITCH) JACK12.RING_B@1(RING) JACK12.RING_T@3(RING) JACK12.SWITCH_B@1(SWITCH) JACK12.SWITCH_T@3(SWITCH) Q1.E Q2.E Q3.E Q6.E Q7.E R17.P$1(E) R44.P$1(E) R68.P$1(E) ; also sheet 1,2,4
KNOB_BALANCE_1: C24.1 R17.P$2(S) ; also sheet 1
KNOB_BALANCE_2: C4.1 R68.P$2(S) ; also sheet 1
KNOB_TEMPO: C41.1 R44.P$2(S) ; also sheet 1
N$2: Q3.B R4.2
N$3: JACK2.TIP_B@1(TIP) JACK2.TIP_T@3(TIP) R16.2
N$4: C15.1 IC4.9(M:-IN) R12.2 R15.1 R16.1
N$6: Q6.B R1.2
N$8: JACK3.TIP_B@1(TIP) JACK3.TIP_T@3(TIP) R1.1
N$11: Q7.B R3.2
N$12: JACK6.TIP_B@1(TIP) JACK6.TIP_T@3(TIP) R3.1
N$15: Q1.B R18.2
N$16: JACK4.TIP_B@1(TIP) JACK4.TIP_T@3(TIP) R18.1
N$17: JACK12.TIP_B@1(TIP) JACK12.TIP_T@3(TIP) R4.1
N$33: JACK1.TIP_B@1(TIP) JACK1.TIP_T@3(TIP) R14.2
N$34: C16.1 IC4.6(L:-IN) R14.1 R22.2 R28.1
N$44: Q2.B R72.2
N$45: JACK5.TIP_B@1(TIP) JACK5.TIP_T@3(TIP) R72.1
REF_-5V [heavypower]: R15.2 R28.2 ; also sheet 4
RESET_PATTERN: Q1.C R20.1 ; also sheet 1
START_1: Q6.C R2.1
START_2: Q7.C R11.1
Unconnected: IC4.1(K:OUT) IC4.2(K:-IN) IC4.3(K:+IN) IC4.12(N:+IN) IC4.13(N:-IN) IC4.14(N:OUT) JACK1.SECOND_B@1(SECOND) JACK1.SECOND_T@3(SECOND) JACK2.SECOND_B@1(SECOND) JACK2.SECOND_T@3(SECOND) JACK3.SECOND_B@1(SECOND) JACK3.SECOND_T@3(SECOND) JACK4.SECOND_B@1(SECOND) JACK4.SECOND_T@3(SECOND) JACK5.SECOND_B@1(SECOND) JACK5.SECOND_T@3(SECOND) JACK6.SECOND_B@1(SECOND) JACK6.SECOND_T@3(SECOND) JACK12.SECOND_B@1(SECOND) JACK12.SECOND_T@3(SECOND)

### Notes on the sheet
- -5.0 to 5.0 -> 3.3 -> 0.0
- -5.0 to 5.0 -> 3.3 -> 0.0

## Library data of the parts
C1 C2 C4 C7 C14 C17 C20 C24 C41-C46 = resistor:C-EU: CAPACITOR, European symbol; MF: MULTICOMP; MPN: MC0603F104Z160CT; OC_FARNELL: 1759017
C5 C23 C48 = EurorackModularParts:C-POLAR*; MF: AVX; MPN: TAJB106K020RNJ; OC_FARNELL: 197427
C6 = resistor:C-EU: CAPACITOR, European symbol; MF: AVX; MPN: 06035C104KAT2A; OC_FARNELL: 1301804
C8 C11 C38 C47 C49-C59 = OPL:C*
C15 C16 = OPL:C*; OC_FARNELL: unknown
D1 D2 = OPL:D*: DIODE; MF: VISHAY; MPN: US1G-E3/5AT; OC_FARNELL: 9551824
D3 D6-D9 = EurorackModularParts:LED*: LED
D18 = OPL:D*: DIODE
IC1 IC8 = 74xx-eu:74*165: 8-bit parallel load SHIFT REGISTER
IC2 = EurorackModularParts:TL074: OP AMP
IC3 = EurorackModularParts:NE5532: AUDIO AMPLIFIER
IC4 = EurorackModularParts:MCP6004; MF: MICROCHIP; MPN: MCP6004-I/SL.; OC_FARNELL: 1605572
IC5-IC7 = FarnellThings:74HC595BQ: 8-bit serial-in, serial or parallel-out shift register,QFN-16; MF: NXP; MPN: 74HC595BQ; OC_FARNELL: 2164850; OC_NEWARK: 43W8000; PACKAGE: QFN-16; SUPPLIER: NXP
J14 = EurorackModularParts:POWER_SIMPLE; OC_FARNELL: unknown
JACK1 = EurorackModularParts:AUDIO-JACK_SMALLSYMBOL: Switching Mono 3.5mm Audio Jack from Erthenvar.; DESC: Balance 1
JACK2 = EurorackModularParts:AUDIO-JACK_SMALLSYMBOL: Switching Mono 3.5mm Audio Jack from Erthenvar.; DESC: Balance 2
JACK3 = EurorackModularParts:AUDIO-JACK_SMALLSYMBOL: Switching Mono 3.5mm Audio Jack from Erthenvar.; DESC: Start 1
JACK4 = EurorackModularParts:AUDIO-JACK_SMALLSYMBOL: Switching Mono 3.5mm Audio Jack from Erthenvar.; DESC: Reset
JACK5 = EurorackModularParts:AUDIO-JACK_SMALLSYMBOL: Switching Mono 3.5mm Audio Jack from Erthenvar.; DESC: Sync
JACK6 = EurorackModularParts:AUDIO-JACK_SMALLSYMBOL: Switching Mono 3.5mm Audio Jack from Erthenvar.; DESC: Start 2
JACK7 = EurorackModularParts:AUDIO-JACK_SMALLSYMBOL: Switching Mono 3.5mm Audio Jack from Erthenvar.; DESC: In 1
JACK8 = EurorackModularParts:AUDIO-JACK_SMALLSYMBOL: Switching Mono 3.5mm Audio Jack from Erthenvar.; DESC: In 2
JACK9 = EurorackModularParts:AUDIO-JACK_SMALLSYMBOL: Switching Mono 3.5mm Audio Jack from Erthenvar.; DESC: Clock
JACK10 = EurorackModularParts:AUDIO-JACK_SMALLSYMBOL: Switching Mono 3.5mm Audio Jack from Erthenvar.; DESC: Out 1
JACK11 = EurorackModularParts:AUDIO-JACK_SMALLSYMBOL: Switching Mono 3.5mm Audio Jack from Erthenvar.; DESC: Out 2
JACK12 = EurorackModularParts:AUDIO-JACK_SMALLSYMBOL: Switching Mono 3.5mm Audio Jack from Erthenvar.; DESC: Arm 1
L1-L4 = OPL:L*
OUTLINE = EurorackModularParts:EURORACK_PCB; OC_FARNELL: unknown
Q1-Q3 Q5-Q7 = transistor:*-NPN-: NPN Transistror BF959 corrected 2008.03.06; MF: NXP; MPN: PMBT3904,215; OC_FARNELL: 2336795
R1-R16 R18-R32 R35-R43 R45-R51 R53-R61 R72 R73 = OPL:R*; OC_FARNELL: unknown
R17 = EurorackModularParts:POT; DESC: Balance 1; OC_FARNELL: unknown
R44 = EurorackModularParts:POT; DESC: Tempo; OC_FARNELL: unknown
R62-R67 R69-R71 R75-R89 = OPL:R*
R68 = EurorackModularParts:POT; DESC: Balance 2; OC_FARNELL: unknown
RN1 RN2 RN5-RN7 = resistor-dil:4R-N: Array Chip Resistor Source: RS Component / Phycomp; OC_FARNELL: unknown; OC_NEWARK: unknown
TP6 TP7 = testpad:PTR1: TEST PIN
U1 = FarnellThings:LM4040DIM3-5.0: IC, Precision Micropower Shunt Voltage Reference, 5V,SOT-23-3; MF: TEXAS INSTRUMENTS; MPN: LM4040DIM3-5.0; OC_FARNELL: 9778330; OC_NEWARK: 97K3489; PACKAGE: SOT-23-3; SUPPLIER: TEXAS INSTRUMENTS
U$1 U$11-U$13 U$23 U$24 U$28 U$31-U$44 = zephod-components:SWITCH_W_LED_PB6149L-X-102
U$5 = EurorackModularParts:BL9342
U$50 = EurorackModularParts:MCP6022
U$55 = FenixBase:MCUPLUGIN2

## Net classes
0 default: width 0.203 mm, clearance 0.178 mm
1 heavypower: width 0.305 mm
2 mediumpower: width 0.254 mm
3 groundplane: width 0.203 mm, clearance 0.203 mm
4 returnground: width 0.356 mm
5 reallyheav: width 0.762 mm

## Board
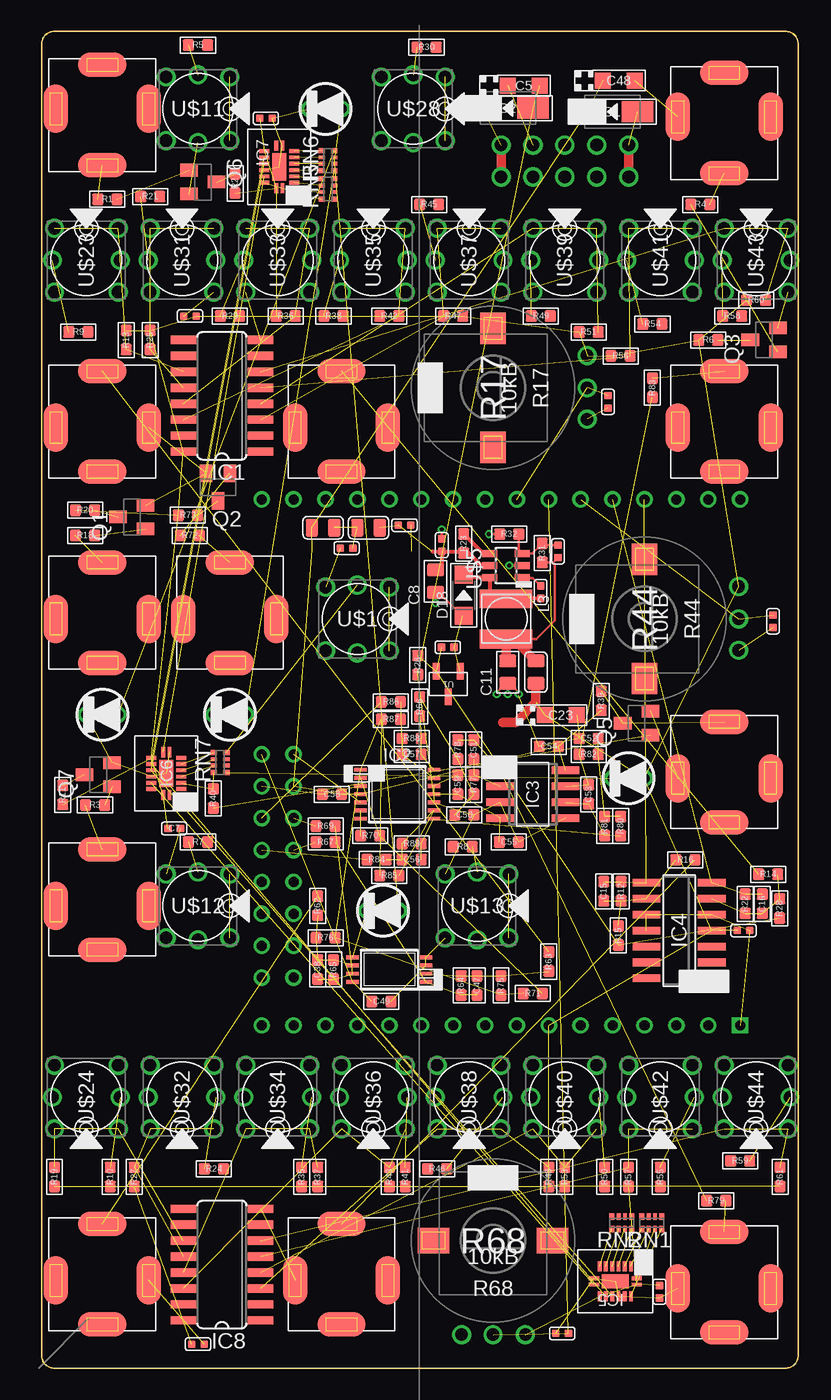
[diagram p6: board, top side]
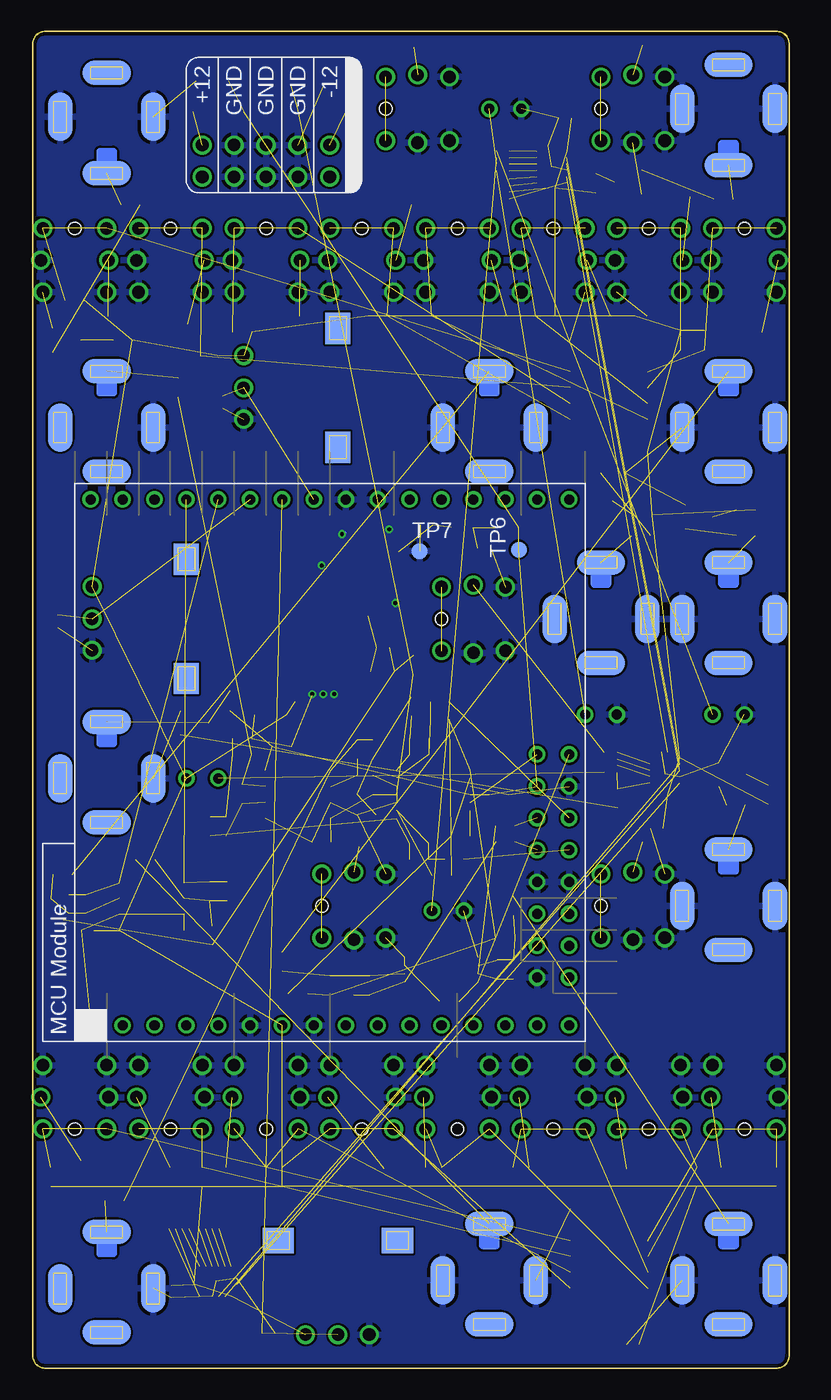
[diagram p7: board, bottom side, seen from below]

Size 60.25 x 106.5 mm. Coordinates in mm from the lower left corner, seen from the top.
Copper layers (1*16): Top 0.035mm / dielectric 1.5mm / Bottom 0.035mm
Design rules "dirt_cheap_dirty_boards.v1.1": minimum track width 6mil, minimum drill 12mil, track to track 6mil, track to pad 6mil, pad to pad 6mil, via to via 6mil, smd to smd 0mil, copper to edge 10mil, drill to drill 10mil, minimum pad ring 10mil, minimum via ring 6mil, stop-mask expansion 2mil, vias tented up to drill 25mil, thermal gap 10mil

### Footprints (pad centres in the part's own frame; a part is rotated, then mirrored left to right if it is on the bottom)
C0402 = smd 0.6 x 0.6: 1 -0.5,0; 2 0.5,0
CASE-A_3216 = smd 1.27 x 1.27: + -1.27,0; - 1.27,0
C0805 = smd 1.016 x 1.397: 1 -0.889,0; 2 0.889,0
C0603 = smd 0.889 x 0.889: 1 -0.762,0; 2 0.762,0
DO-214AC = smd 2.5 x 1.7: 1 -2,0; 2 2,0
3MMLED = drill 0.8: + -1.27,0; - 1.27,0
SOD123 = smd 1.397 x 1.397: + -1.651,0; - 1.651,0
SO16 = smd 0.66 x 2.032: 1 -4.445,-3.073; 2 -3.175,-3.073; 3 -1.905,-3.073; 4 -0.635,-3.073; 5 0.635,-3.073; 6 1.905,-3.073; 7 3.175,-3.073; 8 4.445,-3.073; 9 4.445,3.073; 10 3.175,3.073; 11 1.905,3.073; 12 0.635,3.073; 13 -0.635,3.073; 14 -1.905,3.073; 15 -3.175,3.073; 16 -4.445,3.073
TSSOP14 = smd 0.305 x 0.991: 1 -1.95,-2.918; 2 -1.3,-2.918; 3 -0.65,-2.918; 4 0,-2.918; 5 0.65,-2.918; 6 1.3,-2.918; 7 1.95,-2.918; 8 1.95,2.918; 9 1.3,2.918; 10 0.65,2.918; 11 0,2.918; 12 -0.65,2.918; 13 -1.3,2.918; 14 -1.95,2.918
SO08 = smd 0.6 x 2.2: 1 -1.905,-2.6; 2 -0.635,-2.6; 3 0.635,-2.6; 4 1.905,-2.6; 5 1.905,2.6; 6 0.635,2.6; 7 -0.635,2.6; 8 -1.905,2.6
SO14 = smd 0.6 x 2.2: 1 -3.81,-2.6; 2 -2.54,-2.6; 3 -1.27,-2.6; 4 0,-2.6; 5 1.27,-2.6; 6 2.54,-2.6; 7 3.81,-2.6; 8 3.81,2.6; 9 2.54,2.6; 10 1.27,2.6; 11 0,2.6; 12 -1.27,2.6; 13 -2.54,2.6; 14 -3.81,2.6
QFN50P250X350X100-17N = smd 0.305 x 0.813: 1 -0.254,1.702; 8 -0.254,-1.702; 9 0.254,-1.702; 16 0.254,1.702 | smd 0.813 x 0.305: 2 -1.194,1.245; 3 -1.194,0.762; 4 -1.194,0.254; 5 -1.194,-0.254; 6 -1.194,-0.762; 7 -1.194,-1.245; 10 1.194,-1.245; 11 1.194,-0.762; 12 1.194,-0.254; 13 1.194,0.254; 14 1.194,0.762; 15 1.194,1.245 | smd 1.143 x 2.159: 17 0,0
POWER_10 = drill 1.016: 1 -5.08,-1.27; 2 -5.08,1.27; 3 -2.54,-1.27; 4 -2.54,1.27; 5 0,-1.27; 6 0,1.27; 7 2.54,-1.27; 8 2.54,1.27; 9 5.08,-1.27; 10 5.08,1.27
3.5MM-JACK-SWITCH-13MM-NOHOLES-TESTPAD = smd 1.95 x 3.85 bottom: RING_B@1 -3.7,0; SWITCH_B@1 3.7,0 | smd 1.95 x 3.85: RING_T@3 -3.7,0; SWITCH_T@3 3.7,0 | smd 3.85 x 1.95 bottom: SECOND_B@1 0,-3.5; TIP_B@1 0,4.5 | smd 3.85 x 1.95: SECOND_T@3 0,-3.5; TIP_T@3 0,4.5
L0805 = smd 1.016 x 1.397: 1 -0.889,0; 2 0.889,0
L0420 = smd 1.5 x 4.2: 1 -1.6,0; 2 1.6,0
SOT23-BEC = smd 1 x 1.4: B -0.95,-1.1; C 0,1.1; E 0.95,-1.1
R0603 = smd 0.889 x 0.889: 1 -0.762,0; 2 0.762,0
ALPS_POT_SQUAREHOLES = drill 1: P$1 -2.5,-7.5; P$2 0,-7.5; P$3 2.58,-7.5 | smd 2.5 x 2: P$4 -4.75,0; P$5 4.75,0 | smd 2.5 x 2 bottom: P$6 -4.75,0; P$7 4.75,0
4X0402ARV341 = smd 0.4 x 0.5: 1 -0.8,-0.5; 4 0.8,-0.5; 5 0.8,0.5; 8 -0.8,0.5 | smd 0.3 x 0.5: 2 -0.25,-0.5; 3 0.25,-0.5; 6 0.25,0.5; 7 -0.25,0.5
B1,27 = smd 1.27 x 1.27: TP 0,0
SOT95P237X112-3N = smd 1.321 x 0.559: 1 -1.016,0.94; 2 -1.016,-0.94; 3 1.016,0
PB6149L = drill 1: 1 2.54,2.54; 2 2.54,-2.54; 3 -2.54,2.54; 4 -2.54,-2.54; LEDNEG 0,-2.7; LEDPOS 0,2.7 | hole 1: 2.54,0
SOT23-6 = smd 0.55 x 1.2: 1 -0.95,-1.3; 2 0,-1.3; 3 0.95,-1.3; 4 0.95,1.3; 5 0.003,1.3; 6 -0.95,1.3
TSSOP8 = smd 0.305 x 0.991: 1 -0.975,-2.918; 2 -0.325,-2.918; 3 0.325,-2.918; 4 0.975,-2.918; 5 0.975,2.918; 6 0.325,2.918; 7 -0.325,2.918; 8 -0.975,2.918
MCUPLUGIN = drill 0.8 square: P$1 -1.27,0 | drill 0.8: P$2 -1.27,-2.54; P$3 -1.27,-5.08; P$4 -1.27,-7.62; P$5 -1.27,-10.16; P$6 -1.27,-12.7; P$7 -1.27,-15.24; P$8 -1.27,-17.78; P$9 -1.27,-20.32; P$10 -1.27,-22.86; P$11 -1.27,-25.4; P$12 -1.27,-27.94; P$13 -1.27,-30.48; P$14 -1.27,-33.02; P$15 -1.27,-35.56; P$16 -1.27,-38.1; P$17 40.64,-38.1; P$18 40.64,-35.56; P$19 40.64,-33.02; P$20 40.64,-30.48; P$21 40.64,-27.94; P$22 40.64,-25.4; P$23 40.64,-22.86; P$24 40.64,-20.32; P$25 40.64,-17.78; P$26 40.64,-15.24; P$27 40.64,-12.7; P$28 40.64,-10.16; P$29 40.64,-7.62; P$30 40.64,-5.08; P$31 40.64,-2.54; P$32 40.64,0; P$33 2.54,-35.56; P$34 2.54,-38.1; P$35 5.08,-35.56; P$36 5.08,-38.1; P$37 7.62,-35.56; P$38 7.62,-38.1; P$39 10.16,-35.56; P$40 10.16,-38.1; P$41 12.7,-35.56; P$42 12.7,-38.1; P$43 15.24,-35.56; P$44 15.24,-38.1; P$45 17.78,-35.56; P$46 17.78,-38.1; P$47 20.32,-35.56; P$48 20.32,-38.1

### Placement (x,y rotation side)
C1  11.82,83.82 0 top
C2  12.45,1.91 180 top
C4  41.45,2.77 180 top
C5  38.4,102.18 0 top
C6  32.34,57.42 180 top
C7  10.55,42.99 180 top
C8  31.37,62.7 90 top
C11  37.12,55.45 90 top
C14  49.2,6.09 90 top
C15  44.77,37.99 90 top
C16  57.4,36.99 90 top
C17  55.9,34.86 0 top
C20  17.86,99.58 180 top
C23  41.33,52.02 0 top
C24  45.1,76.98 270 top
C38  21.98,31.75 90 top
C41  58.24,59.5 270 top
C42  24.29,65.34 0 top
C43  31.87,65.57 270 top
C44  28.9,67.16 180 top
C45  39.74,61.82 90 top
C46  41.12,65.07 90 top
C47  34.68,30.48 90 top
C48  45.96,102.58 0 top
C49  27.05,29.21 180 top
C50  33.66,44.07 180 top
C51  34.42,49.28 270 top
C52  43.57,50.16 0 top
C53  43.57,45.72 270 top
C54  40.39,49.53 0 top
C55  37.21,41.91 0 top
C56  29.47,40.51 180 top
C57  29.47,48.89 180 top
C58  23.12,45.72 0 top
C59  33.15,46.48 90 top
D1  45.46,100.09 180 top
D2  37.15,100.39 180 top
D3  46.74,46.99 180 top
D6  14.99,52.07 180 top
D7  22.61,100.33 180 top
D8  27.18,36.44 180 top
D9  4.83,52.07 180 top
D18  33.62,61.57 90 top
IC1  14.35,77.47 90 top
IC2  28.32,45.72 270 top
IC3  39.12,45.72 270 top
IC4  50.77,34.86 90 top
IC5  45.68,6.91 270 top
IC6  9.93,47.38 180 top
IC7  18.93,95.7 180 top
IC8  14.35,8.25 90 top
J14  41.67,96.17 180 bottom
JACK1  23.88,74.93 0 top
JACK2  23.88,6.98 0 top
JACK3  4.83,100.33 180 top
JACK4  4.83,59.69 0 top
JACK5  14.99,59.69 0 top
JACK6  4.83,36.83 0 top
JACK7  4.83,74.93 0 top
JACK8  4.83,6.98 0 top
JACK9  54.36,46.99 0 top
JACK10  54.36,74.93 0 top
JACK11  54.36,6.35 0 top
JACK12  54.36,99.69 180 top
L1  22.41,66.96 0 top
L2  26.04,66.96 0 top
L3  36.99,59.7 270 top
L4  39.37,55.45 270 top
OUTLINE  -0.25,0 0 top
Q1  7.18,67.81 90 top
Q2  14.04,70.19 180 top
Q3  57.54,81.91 90 top
Q5  47.38,51.38 90 top
Q6  12.84,94.49 270 top
Q7  4.51,47.28 90 top
R1  5.23,93.12 0 top
R2  15.4,94.38 270 top
R3  4.25,44.86 0 top
R4  52.46,92.71 180 top
R5  12.45,105.41 0 top
R6  53.09,81.91 180 top
R7  12.45,41.91 0 top
R8  33.53,41.53 180 top
R9  2.93,82.55 0 top
R10  5.46,15.24 270 top
R11  1.67,45.66 270 top
R12  46.15,37.99 270 top
R13  6.73,81.91 270 top
R14  57.86,39.34 180 top
R15  45.93,34.46 270 top
R16  51.27,40.49 0 top
R17  35.95,78.1 90 top
R18  3.46,66.34 0 top
R19  1.02,15.24 90 top
R20  3.46,68.35 180 top
R21  8.64,93.34 0 top
R22  56.02,36.99 270 top
R23  33.62,65.7 270 top
R24  13.72,15.88 0 top
R25  8.64,81.91 270 top
R26  29.96,56.01 90 top
R27  7.37,15.24 90 top
R28  58.77,36.61 270 top
R29  14.99,83.82 0 top
R30  30.65,105.24 0 top
R31  39.87,64.95 90 top
R32  37.24,66.45 180 top
R35  20.71,15.24 270 top
R36  19.43,83.82 0 top
R37  21.98,15.24 90 top
R38  23.24,83.82 0 top
R39  44.57,53.17 270 top
R40  13.67,45.38 270 top
R41  28.96,15.24 270 top
R42  27.69,83.82 0 top
R43  27.69,15.24 90 top
R44  48.01,59.69 90 top
R45  30.87,92.71 0 top
R46  31.5,15.88 180 top
R47  32.77,83.82 180 top
R48  40.39,15.24 90 top
R49  39.76,83.82 0 top
R50  44.84,15.24 270 top
R51  43.57,82.55 0 top
R53  41.66,15.24 90 top
R54  48.65,83.19 0 top
R55  49.28,15.24 270 top
R56  46.1,80.64 0 top
R57  46.74,15.24 90 top
R58  54.99,83.82 0 top
R59  55.63,16.51 180 top
R60  56.9,85.09 0 top
R61  58.8,15.24 90 top
R62  21.98,36.83 270 top
R63  40.39,32.39 270 top
R64  33.4,30.48 270 top
R65  23.24,31.75 270 top
R66  30.1,52.7 90 top
R67  22.61,41.91 180 top
R68  35.95,10.16 0 top
R69  22.61,43.18 180 top
R70  26.17,42.42 0 top
R71  39.12,29.84 180 top
R72  11.79,66.34 180 top
R73  11.65,67.95 180 top
R75  36.58,30.48 90 top
R76  22.61,34.29 180 top
R77  34.42,46.48 90 top
R78  33.15,49.28 90 top
R79  53.73,13.33 0 top
R80  46.1,43.18 90 top
R81  44.84,43.18 270 top
R82  43.57,48.89 180 top
R83  48.65,78.1 90 top
R84  26.67,40.51 0 top
R85  27.69,39.24 0 top
R86  27.82,53.09 0 top
R87  27.82,51.69 0 top
R88  29.47,50.16 0 top
R89  29.47,41.78 0 top
RN1  48.59,11.58 0 top
RN2  46.21,11.58 0 top
RN5  22.8,93.95 270 top
RN6  22.8,96.2 270 top
RN7  14.21,48.25 270 top
TP6  21.54,65.21 90 bottom
TP7  29.43,65.09 0 bottom
U1  32.38,54.5 270 top
U$1  25.15,59.69 0 top
U$5  36.99,63.95 90 top
U$11  12.45,100.33 0 top
U$12  12.45,36.83 0 top
U$13  34.68,36.83 0 top
U$23  3.56,88.27 90 top
U$24  3.56,21.59 270 top
U$28  29.6,100.33 0 top
U$31  11.18,88.27 90 top
U$32  11.18,21.59 270 top
U$33  18.8,88.27 90 top
U$34  18.8,21.59 270 top
U$35  26.42,88.27 90 top
U$36  26.42,21.59 270 top
U$37  34.04,88.27 90 top
U$38  34.04,21.59 270 top
U$39  41.66,88.27 90 top
U$40  41.66,21.59 270 top
U$41  49.28,88.27 90 top
U$42  49.28,21.59 270 top
U$43  56.9,88.27 90 top
U$44  56.9,21.59 270 top
U$50  27.69,31.75 90 top
U$55  55.63,28.58 90 bottom

### Tracks (layer width: path | path; a pad name or v marks a point on that pad's centre or on a via)
1_1_BUT  (3 unrouted)
1_2_BUT  (3 unrouted)
1_3_BUT  (3 unrouted)
1_4_BUT  (3 unrouted)
1_5_BUT  (3 unrouted)
1_6_BUT  (3 unrouted)
1_7_BUT  (3 unrouted)
1_8_BUT  (3 unrouted)
2_1_BUT  (3 unrouted)
2_2_BUT  (3 unrouted)
2_3_BUT  (3 unrouted)
2_4_BUT  (3 unrouted)
2_5_BUT  (3 unrouted)
2_6_BUT  (3 unrouted)
2_7_BUT  (3 unrouted)
2_8_BUT  (3 unrouted)
3.3V  (42 unrouted)
  Top 0.762: L4.2 39.37,53.07 37.74,51.45 36.74,51.45
3V3_AUDIO  (2 unrouted)
12V  (9 unrouted)
-12V  (6 unrouted)
ADC_BALANCE_1  (3 unrouted)
ADC_BALANCE_2  (3 unrouted)
ARM1_1  (1 unrouted)
ARM2_1  (1 unrouted)
ARM_1  (1 unrouted)
ARM_1_BUT  (1 unrouted)
ARM_2_BUT  (1 unrouted)
BIAS_AUDIO  (1 unrouted)
BIAS_BUFFERED  (2 unrouted)
BIAS_INVERTED  (5 unrouted)
CLOCK  (2 unrouted)
CLOCK_IN  (1 unrouted)
GND  (via drill 0.3)  (51 unrouted)
  Top 0.203: C43.1 v31.87,66.82 | R32.2 35.98,66.46 v35.62,66.45 | U$5.2 v37.24,63.95 | v31.37,60.95 C8.1 31.73,61.45 31.99,61.45 33.52,59.92 D18.+ | C11.1 v37.12,53.7 | C11.1 37.25,54.56 37.99,53.82 v37.99,53.7 | C11.1 36.98,54.56 36.24,53.82 v36.24,53.7
  Bottom 0.203: v31.87,66.82 31.62,66.82 | v35.62,66.45 35.37,66.57 | v37.24,63.95 37.12,63.95 | v37.12,53.7 37.12,53.57 | v37.99,53.7 37.99,53.57 | v36.24,53.7 36.24,53.57
  pour Bottom: -2.16,108.58 -6.6,-0.64 63.25,-2.54 65.79,111.76
KNOB_BALANCE_1  (2 unrouted)
KNOB_BALANCE_2  (2 unrouted)
KNOB_TEMPO  (2 unrouted)
LATCH  (2 unrouted)
N$1  (1 unrouted)
N$2  (1 unrouted)
N$3  (1 unrouted)
N$4  (4 unrouted)
N$5  (1 unrouted)
N$6  (1 unrouted)
N$7  (1 unrouted)
N$8  (1 unrouted)
N$9  (1 unrouted)
N$10  (1 unrouted)
N$11  (1 unrouted)
N$12  (1 unrouted)
N$13  (1 unrouted)
  Top 0.762: J14.10 J14.9
N$14  (1 unrouted)
N$15  (1 unrouted)
N$16  (1 unrouted)
N$17  (1 unrouted)
N$19  (1 unrouted)
N$20  (1 unrouted)
N$21  (1 unrouted)
N$22  (1 unrouted)
N$23  (1 unrouted)
N$25  (1 unrouted)
N$26  (1 unrouted)
N$27  (1 unrouted)
N$28  (1 unrouted)
N$29  (1 unrouted)
N$30  (1 unrouted)
N$31  (1 unrouted)
N$32  (1 unrouted)
N$33  (1 unrouted)
N$34  (4 unrouted)
N$35  (1 unrouted)
N$36  (1 unrouted)
N$37  (1 unrouted)
N$38  (1 unrouted)
N$39  (1 unrouted)
N$40  (1 unrouted)
N$42  (1 unrouted)
N$43  (1 unrouted)
N$44  (1 unrouted)
N$45  (1 unrouted)
N$46  (1 unrouted)
N$49  (1 unrouted)
N$50  (1 unrouted)
N$51  (1 unrouted)
N$53  (1 unrouted)
N$54  (1 unrouted)
N$55  (1 unrouted)
N$56  (1 unrouted)
N$57  (1 unrouted)
N$58  (1 unrouted)
N$59  (1 unrouted)
N$60  (1 unrouted)
N$61  (2 unrouted)
N$62  (1 unrouted)
N$63  (1 unrouted)
N$64  (1 unrouted)
  Top 0.762: J14.2 J14.1
N$70  (2 unrouted)
N$71  (1 unrouted)
N$75  (4 unrouted)
N$77  (4 unrouted)
N$78  (3 unrouted)
N$79  (3 unrouted)
N$83  (2 unrouted)
N$84  (2 unrouted)
N$85  (3 unrouted)
N$88  (3 unrouted)
N$89  (1 unrouted)
N$90  (2 unrouted)
N$91  (3 unrouted)
N$92  (3 unrouted)
N$93  (2 unrouted)
  Top 0.305: 31.12,65.07 C43.2 | U$5.5 34.99,63.95 34,64.94 R23.2 33.48,65.07 C43.2 | C43.2 31.87,64.09 C8.2
N$94  (1 unrouted)
N$95
  Top 0.203: U$5.1 38.04,63 38.49,62.95 39.12,62.95 C45.2
N$96
  Top 0.305: D18.- 33.84,63 U$5.6 35.69,61.38 L3.1 37.01,61.32 C45.1
N$97
  Top 0.203: C46.2 40,65.57 R31.2 39.05,64.9 U$5.3 38,65.19 R32.1
N$98
  Top 0.203: 36.99,56.82 L3.2 37.17,58.1 39.39,58.1 40.87,59.57 40.87,64.05 40.73,64.19 | 36.99,56.7 36.99,56.46 C11.2 | R31.1 40.73,64.19 | 40.73,64.19 C46.1
  Top 0.762: 37.17,58.1 37.6,58.1 L4.1 | 36.99,58.2 36.99,56.82 36.99,56.7 36.99,56.45
N$99
  Top 0.305: U$5.4 35.18,64.9 R23.1
N$101  (4 unrouted)
N$102  (4 unrouted)
N$103  (3 unrouted)
N$104  (1 unrouted)
N$105  (1 unrouted)
N$106  (3 unrouted)
N$107  (1 unrouted)
N$108  (1 unrouted)
OUT_CLOCK  (2 unrouted)
REF_-5V  (4 unrouted)
RESET_PATTERN  (1 unrouted)
SHIFT_BUT  (1 unrouted)
SHIFT_LED  (1 unrouted)
SHIFTER1TO2  (1 unrouted)
SHIFTERS2TO3  (1 unrouted)
START_1  (1 unrouted)
START_1_BUT  (1 unrouted)
START_2  (1 unrouted)
START_2_BUT  (1 unrouted)
TO_AUDIOIN_1  (1 unrouted)
TO_AUDIOIN_2  (1 unrouted)
TRIGGERBUTTON  (1 unrouted)

### Text on the board
tNames: U$1